# Altium project Velvet_Controller_V2.0_2023.PrjPcb (part 2 of 3)

## Sheet Схема LoRa и RFID Velvet Controller.SchDoc
size A3; SheetNumber: 3; SheetTotal: 6
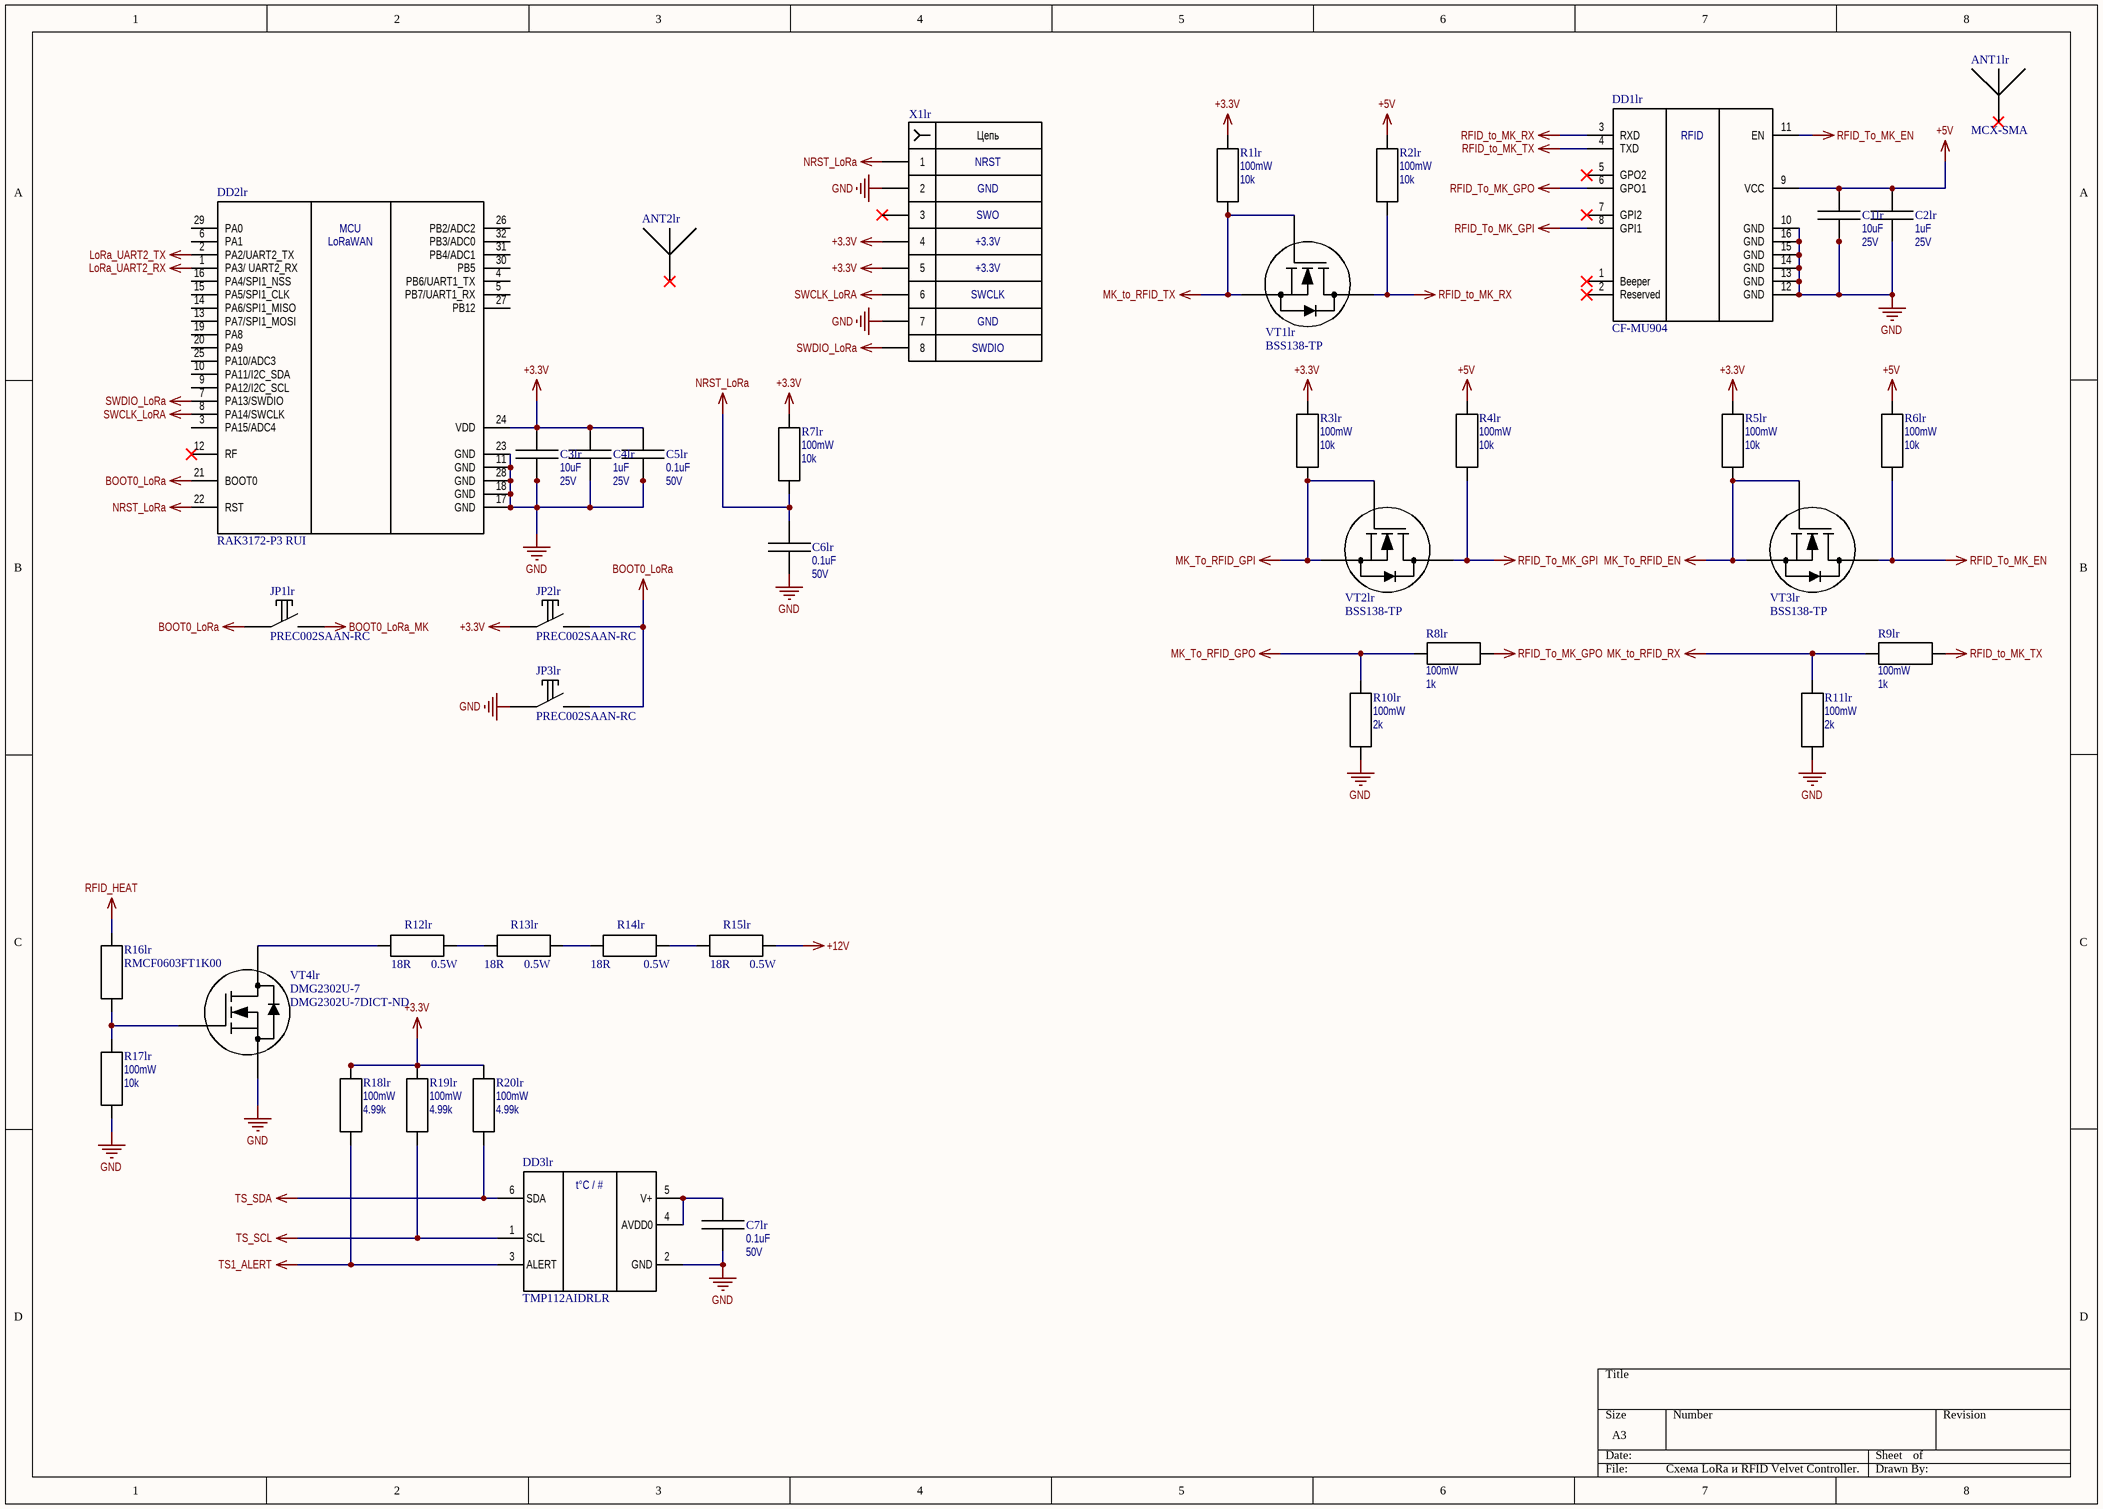
[diagram p3: Схема LoRa и RFID Velvet Controller.SchDoc]

### Parts
ANT1lr  MCX-SMA  (mechanical)
ANT2lr  CA-DKCA0-152L0-AJI0-O  (value not drawn)  (mechanical)
C1lr  Capacitance: 10uF  Rated Voltage: 25V  [CAP 1206 IPC MAX]  (hidden comment: CL31B106KAHNNNE)
C2lr  Capacitance: 1uF  Rated Voltage: 25V  [CAP 0603 IPC MAX]  (hidden comment: TMK107BJ105KA-T)
C3lr  Capacitance: 10uF  Rated Voltage: 25V  [CAP 1206 IPC MAX]  (hidden comment: CL31B106KAHNNNE)
C4lr  Capacitance: 1uF  Rated Voltage: 25V  [CAP 0603 IPC MAX]  (hidden comment: TMK107BJ105KA-T)
C5lr  Capacitance: 0.1uF  Rated Voltage: 50V  [CAP 0603 IPC MAX]  (hidden comment: GCM188R71H104KA57D)
C6lr  Capacitance: 0.1uF  Rated Voltage: 50V  [CAP 0603 IPC MAX]  (hidden comment: GCM188R71H104KA57D)
C7lr  Capacitance: 0.1uF  Rated Voltage: 50V  [CAP 0603 IPC MAX]  (hidden comment: GCM188R71H104KA57D)
DD1lr  CF-MU904  [CF-MU904]
DD2lr  RAK3172-P3 RUI  [RAK3172]
DD3lr  TMP112AIDRLR  [SOT-563]
JP1lr  PREC002SAAN-RC  [2P TH 2.54mm]
JP2lr  PREC002SAAN-RC  [2P TH 2.54mm]
JP3lr  PREC002SAAN-RC  [2P TH 2.54mm]
R1lr  Power Rated: 100mW  Resistance: 10k  [RES 0603 IPC MAX]  (hidden comment: RMCF0603JT10K0)
R2lr  Power Rated: 100mW  Resistance: 10k  [RES 0603 IPC MAX]  (hidden comment: RMCF0603JT10K0)
R3lr  Power Rated: 100mW  Resistance: 10k  [RES 0603 IPC MAX]  (hidden comment: RMCF0603JT10K0)
R4lr  Power Rated: 100mW  Resistance: 10k  [RES 0603 IPC MAX]  (hidden comment: RMCF0603JT10K0)
R5lr  Power Rated: 100mW  Resistance: 10k  [RES 0603 IPC MAX]  (hidden comment: RMCF0603JT10K0)
R6lr  Power Rated: 100mW  Resistance: 10k  [RES 0603 IPC MAX]  (hidden comment: RMCF0603JT10K0)
R7lr  Power Rated: 100mW  Resistance: 10k  [RES 0603 IPC MAX]  (hidden comment: RMCF0603JT10K0)
R8lr  Rated Power: 100mW  Resistance: 1k  [RES 0603 IPC MAX]  (hidden comment: RMCF0603FT1K00)
R9lr  Rated Power: 100mW  Resistance: 1k  [RES 0603 IPC MAX]  (hidden comment: RMCF0603FT1K00)
R10lr  Rated Power: 100mW  Resistance: 2k  [RES 0603 IPC MAX]  (hidden comment: RMCF0603FT2K00)
R11lr  Rated Power: 100mW  Resistance: 2k  [RES 0603 IPC MAX]  (hidden comment: RMCF0603FT2K00)
R12lr  Resistance: 18R  Rated Power: 0.5W  [RES 1210]  (hidden comment: RMCF1210JT18R0)
R13lr  Resistance: 18R  Rated Power: 0.5W  [RES 1210]  (hidden comment: RMCF1210JT18R0)
R14lr  Resistance: 18R  Rated Power: 0.5W  [RES 1210]  (hidden comment: RMCF1210JT18R0)
R15lr  Resistance: 18R  Rated Power: 0.5W  [RES 1210]  (hidden comment: RMCF1210JT18R0)
R16lr  RMCF0603FT1K00  [RES 0603 IPC MAX]
R17lr  Power Rated: 100mW  Resistance: 10k  [RES 0603 IPC MAX]  (hidden comment: RMCF0603JT10K0)
R18lr  Rated Power: 100mW  Resistance: 4.99k  [RES 0603 IPC MAX]  (hidden comment: RC0603FR-074K99L)
R19lr  Rated Power: 100mW  Resistance: 4.99k  [RES 0603 IPC MAX]  (hidden comment: RC0603FR-074K99L)
R20lr  Rated Power: 100mW  Resistance: 4.99k  [RES 0603 IPC MAX]  (hidden comment: RC0603FR-074K99L)
VT1lr  BSS138-TP  [SOT-23-3]
VT2lr  BSS138-TP  [SOT-23-3]
VT3lr  BSS138-TP  [SOT-23-3]
VT4lr  DMG2302U-7  Supplier Part Number 1: DMG2302U-7DICT-ND  [SOT-23-3]
X1lr  TSW-104-07-F-D  [HEADER 2.54mm 2ROW 8PIN]  (value not drawn)

### Nets
+3.3V: C3lr.1 C4lr.1 C5lr.1 DD2lr.24(VDD) JP2lr.1 R1lr.2 R3lr.2 R5lr.2 R7lr.2 R18lr.2 R19lr.2 R20lr.2 X1lr.4 X1lr.5
+5V: C1lr.1 C2lr.1 DD1lr.9(VCC) R2lr.2 R4lr.2 R6lr.2
+12V: R15lr.2
BOOT0_LoRa: DD2lr.21(BOOT0) JP1lr.1 JP2lr.2 JP3lr.2
BOOT0_LoRa_MK: JP1lr.2
GND: C1lr.2 C2lr.2 C3lr.2 C4lr.2 C5lr.2 C6lr.2 C7lr.2 DD1lr.10(GND) DD1lr.12(GND) DD1lr.13(GND) DD1lr.14(GND) DD1lr.15(GND) DD1lr.16(GND) DD2lr.11(GND) DD2lr.17(GND) DD2lr.18(GND) DD2lr.23(GND) DD2lr.28(GND) DD3lr.2(GND) JP3lr.1 R10lr.1 R11lr.1 R17lr.1 VT4lr.2(S) X1lr.2 X1lr.7
LoRa_UART2_RX: DD2lr.1(PA3/_UART2_RX)
LoRa_UART2_TX: DD2lr.2(PA2/UART2_TX)
MK_To_RFID_EN: R5lr.1 VT3lr.1(G) VT3lr.2(S)
MK_To_RFID_GPI: R3lr.1 VT2lr.1(G) VT2lr.2(S)
MK_To_RFID_GPO: R8lr.1 R10lr.2
MK_to_RFID_RX: R9lr.1 R11lr.2
MK_to_RFID_TX: R1lr.1 VT1lr.1(G) VT1lr.2(S)
NRST_LoRa: C6lr.1 DD2lr.22(RST) R7lr.1 X1lr.1
RFID_HEAT: R16lr.2
RFID_To_MK_EN: DD1lr.11(EN) R6lr.1 VT3lr.3(D)
RFID_To_MK_GPI: DD1lr.8(GPI1) R4lr.1 VT2lr.3(D)
RFID_To_MK_GPO: DD1lr.6(GPO1) R8lr.2
RFID_to_MK_RX: DD1lr.3(RXD) R2lr.1 VT1lr.3(D)
RFID_to_MK_TX: DD1lr.4(TXD) R9lr.2
SWCLK_LoRA: DD2lr.8(PA14/SWCLK) X1lr.6
SWDIO_LoRa: DD2lr.7(PA13/SWDIO) X1lr.8
TS1_ALERT: DD3lr.3(ALERT) R18lr.1
TS_SCL: DD3lr.1(SCL) R19lr.1
TS_SDA: DD3lr.6(SDA) R20lr.1
NetC7lr_1: C7lr.1 DD3lr.4(AVDD0) DD3lr.5(V+)
NetR12lr_1: R12lr.1 VT4lr.3(D)
NetR12lr_2: R12lr.2 R13lr.1
NetR13lr_2: R13lr.2 R14lr.1
NetR14lr_2: R14lr.2 R15lr.1
NetR16lr_1: R16lr.1 R17lr.2 VT4lr.1(G)

Not connected (* = marked no-connect by the designer): ANT1lr 1*; ANT2lr 1*; DD1lr 1(Beeper)* 2(Reserved)* 5(GPO2)* 7(GPI2)*; DD2lr 3(PA15/ADC4) 4(PB6/UART1_TX) 5(PB7/UART1_RX) 6(PA1) 9(PA12/I2C_SCL) 10(PA11/I2C_SDA) 12(RF)* 13(PA7/SPI1_MOSI) 14(PA6/SPI1_MISO) 15(PA5/SPI1_CLK) 16(PA4/SPI1_NSS) 19(PA8) 20(PA9) 25(PA10/ADC3) 26(PB2/ADC2) 27(PB12) 29(PA0) 30(PB5) 31(PB4/ADC1) 32(PB3/ADC0); X1lr 3*

### Notes on the sheet
- NRST
- SWO
- GND
- +3.3V
- SWCLK
- SWDIO
- (in symbol CF-MU904) RFID
- (in symbol RAK3172-P3 RUI) MCU
- (in symbol TMP112AIDRLR) t°C / #
- (in symbol TSW-104-07-F-D) Цепь

### Library data of the parts
ANT1lr = MCX-SMA: MCX-Male to SMA RF 15cm connector; Manufacturer 1: DexMRtiC; Style: N-MCX Cable; 1st Contact Gender: Female; 1st Connector Mounting Type: Panel Mount; 2nd Connector: MCX Male Plug Right Angle; 2nd Contact Gender: Male; 2nd Connector Mounting Type: Free Hanging (In-Line); Frequency - Max: 6 GHz; Manufacturer Part Number 1: -; 1st Connector: SMA; Length: 152.00mm; ComponentLink1Description: Aliexpress; ComponentLink1URL: https://aliexpress.ru/item/32231629780.html?algo_pvid=null&algo_expid=null&spm=a2g2w.productlist.search_results.6.4f564aa6TSsm48&sku_id=12000026772307438
ANT2lr = CA-DKCA0-152L0-AJI0-O: WATERPROOF SMA TO IPEX FOR 1.13; Manufacturer 1: Adam Tech; Style: U.FL (UMCC), IPEX MHF1 to SMA; 1st Connector: SMA Jack; 1st Contact Gender: Female; 1st Connector Mounting Type: Panel Mount; 1st Connector Mounting Feature: Bulkhead - Front Side Nut; 2nd Connector: U.FL (UMCC), IPEX MHF1 Plug, Right Angle; 2nd Connector Mounting Type: Free Hanging (In-Line); Frequency - Max: 6 GHz; Manufacturer Part Number 1: CA-DKCA0-152L0-AJI0-O; 2nd Contact Gender: Female; 2nd Connector Mounting Feature: *; Length: 152.00mm
C1lr C3lr = CL31B106KAHNNNE: CAP SMD CER 10UF 25V X7R 1206; Manufacturer 1: Samsung Electro-Mechanics; Tolerance: 10%; Type: Multilayer Ceramic; Manufacturer Part Number 1: CL31B106KAHNNNE; Min Operating Temperature: -55°C; Max Operating Temperature: 125°C; Mounting: SM; Package: 1206; Supplier 1: Digi-Key; Supplier Part Number 1: 1276-1804-1-ND
C2lr C4lr = TMK107BJ105KA-T: CAP SMD CER 1UF 25V X5R 0603; Manufacturer 1: Taiyo Yuden; Tolerance: 10%; Type: Multilayer Ceramic; Manufacturer Part Number 1: TMK107BJ105KA-T; Min Operating Temperature: -55°C; Max Operating Temperature: 85°C; Mounting: SM; Package: 0603; Supplier 1: Digi-Key; Supplier Part Number 1: 587-1248-1-ND
C5lr C6lr C7lr = GCM188R71H104KA57D: as C9p on sheet Схема питания Velvet Controller; Manufacturer Part Number 1: GCM188R71H104KA57D; Min Operating Temperature: -55°C; Max Operating Temperature: 125°C; Mounting: SM; Package: 0603; Supplier 1: Digi-Key; Supplier Part Number 1: 490-4779-1-ND
DD1lr = CF-MU904: UHF RFID Reader Module; Manufacturer 1: ChaFon; Frequency Band 1: 902~928MHz; Frequency Band 2: 865~868MHz; Effective Range: 15m; Tag Buffer Size 1: 370PCS@Max.128bitsEPC; Tag Buffer Size 2: 120PCS@Max.496bitsEPC; Min Supply Voltage: 3.5V; Max Supply Voltage: 5V; RSSI: Yes; Interface: UART; Max Supply Current: 360mA; Manufacturer Part Number 1: CF-MU904; Package: *
DD2lr = RAK3172-P3 RUI: MODULE FOR LORAWAN RAK3172; Manufacturer 1: RAKwireless Technology Limited; Function: Transceiver; Frequency: 433MHz, 470MHz, 864MHz, 865MHz, 868MHz, 915MHz, 920MHz, 923MHz; Min Supply Voltage: 2V; Max Supply Voltage: 3.6V; Max Supply Current: 100mA; Manufacturer Part Number 1: RAK3172-P3 RUI; Min Operating Temperature: -40°C; Max Operating Temperature: 85°C; RF Type: LoRaWAN; Package: 32-SMD Module
DD3lr = TMP112AIDRLR: SOT-563 TEMPERATURE SENSORS ROHS; Manufacturer 1: UMW; Max Accuracy: ±0.1°C; Min Accuracy: ±1°C; Resolution: 12b; Interface: I²C/SMBus; Manufacturer Part Number 1: TMP112AIDRLR; Max Operating Temperature: 150°C; Min Operating Temperature: -55°C; Mounting Type: SM; Package: SOT-563; Supplier 1: Digi-Key; Supplier Part Number 1: 296-38578-1-ND
JP1lr JP2lr JP3lr = PREC002SAAN-RC: CONN HEADER VERT 2POS 2.54MM; Manufacturer 1: Sullins Connector Solutions; Manufacturer Part Number 1: PREC002SAAN-RC; Number of Pins: 2; Pitch: 2.54mm
R1lr R2lr R3lr R4lr R5lr R6lr R7lr R17lr = RMCF0603JT10K0: as R4mc on sheet Схема МК и датчиков Velvet Controller; Manufacturer Part Number 1: RMCF0603JT10K0; Min Operating Temperature: -55°C; Max Operating Temperature: 155°C; Tolerance: 5%; Package: 0603; Ratings: AEC-Q200; Supplier 1: Digi-Key; Supplier Part Number 1: RMCF0603JT10K0CT-ND
R8lr R9lr = RMCF0603FT1K00: RES SMD 1K OHM 1% 1/10W 0603; Manufacturer 1: Stackpole Electronics Inc; Rated Voltage: 75V; Qualification: AEC-Q200; Manufacturer Part Number 1: RMCF0603FT1K00; Tolerance: 1%; Package: 0603; Min Operating Temperature: -55°C; Max Operating Temperature: 155°C
R10lr R11lr = RMCF0603FT2K00: RES SMD 2K OHM 1% 1/10W 0603; Manufacturer 1: Stackpole Electronics Inc; Rated Voltage: 75V; Qualification: AEC-Q200; Manufacturer Part Number 1: RMCF0603FT2K00; Tolerance: 1%; Package: 0603; Min Operating Temperature: -55°C; Max Operating Temperature: 155°C
R12lr R13lr R14lr R15lr = RMCF1210JT18R0: RES SMD 18 OHM 5% 1/2W 1210; Manufacturer 1: Stackpole Electronics Inc; Rated Voltage: 200V; Qualification: AEC-Q200; Manufacturer Part Number 1: RMCF1210JT18R0; Tolerance: 5%; Package: 1210; Min Operating Temperature: -55°C; Max Operating Temperature: 155°C
R16lr = RMCF0603FT1K00: RES SMD 1K OHM 1% 1/10W 0603; Manufacturer 1: Stackpole Electronics Inc; Rated Voltage: 75V; Rated Power: 100mW; Qualification: AEC-Q200; Manufacturer Part Number 1: RMCF0603FT1K00; Resistance: 1k; Tolerance: 1%; Package: 0603; Min Operating Temperature: -55°C; Max Operating Temperature: 155°C
R18lr R19lr R20lr = RC0603FR-074K99L: RES SMD 4.99K OHM 1% 1/10W 0603; Manufacturer 1: YAGEO; Rated Voltage: 75V; Manufacturer Part Number 1: RC0603FR-074K99L; Tolerance: 1%; Package: 0603; Min Operating Temperature: -55°C; Max Operating Temperature: 155°C; Qualification: -
VT1lr VT2lr VT3lr = BSS138-TP: MOSFET N-CH 50V 220MA SOT23; Manufacturer 1: Micro Commercial Co; Type: P-Chanel; Rds On (Max): 3.5Ohm; Vth: 1.5V; Gate Charge: 1.65nC; Vgs Max: 20V; Input Capacitance: 60pF; Max Power Dissipation: 350mW; Vds Max: 50V; Max Drain Current: 220mA; Min Operating Temperature: -55°C; Max Operating Temperature: 150°C; Mounting Type: SM; Package: SOT-23; Manufacturer Part Number 1: BSS138-TP; Supplier 1: Digi-Key; Supplier Part Number 1: BSS138-TPMSCT-ND
VT4lr = DMG2302U-7: MOSFET N-CH 20V 4.2A SOT23-3; Manufacturer 1: Diodes Incorporated; Type: P-Chanel; Rds On (Max): 90mOhm; Vth: 1V; Gate Charge: 7nC; Vgs Max: 8V; Input Capacitance: 594pF; Max Power Dissipation: 800mW; Vds Max: 20V; Max Drain Current: 4.2A; Min Operating Temperature: -55°C; Max Operating Temperature: 150°C; Mounting Type: SM; Package: SOT-23-3; Manufacturer Part Number 1: DMG2302U-7; Supplier 1: Digi-Key
X1lr = TSW-104-07-F-D: CONN HEADER VERT 8POS 2.54MM 2ROWx4; Manufacturer 1: Samtec Inc.; Rated Voltage: 400V; Rated Current: 2A; Contact Length - Mating: 5.84mm; Overall Contact Length: 10.92mm; Min Operating Temperatire: -55℃; Max Operating Temperature: 125℃; Contact Length - Post: 2.54mm; Insulation Height: 2.54mm; Manufacturer Part Number 1: TSW-104-07-F-D; Pitch: 2.54mm; Supplier 1: Digi-Key; Supplier Part Number 1: SAM8996-ND

## Sheet Схема Wi-Fi Velvet Controller.SchDoc
size A3; SheetNumber: 4; SheetTotal: 6
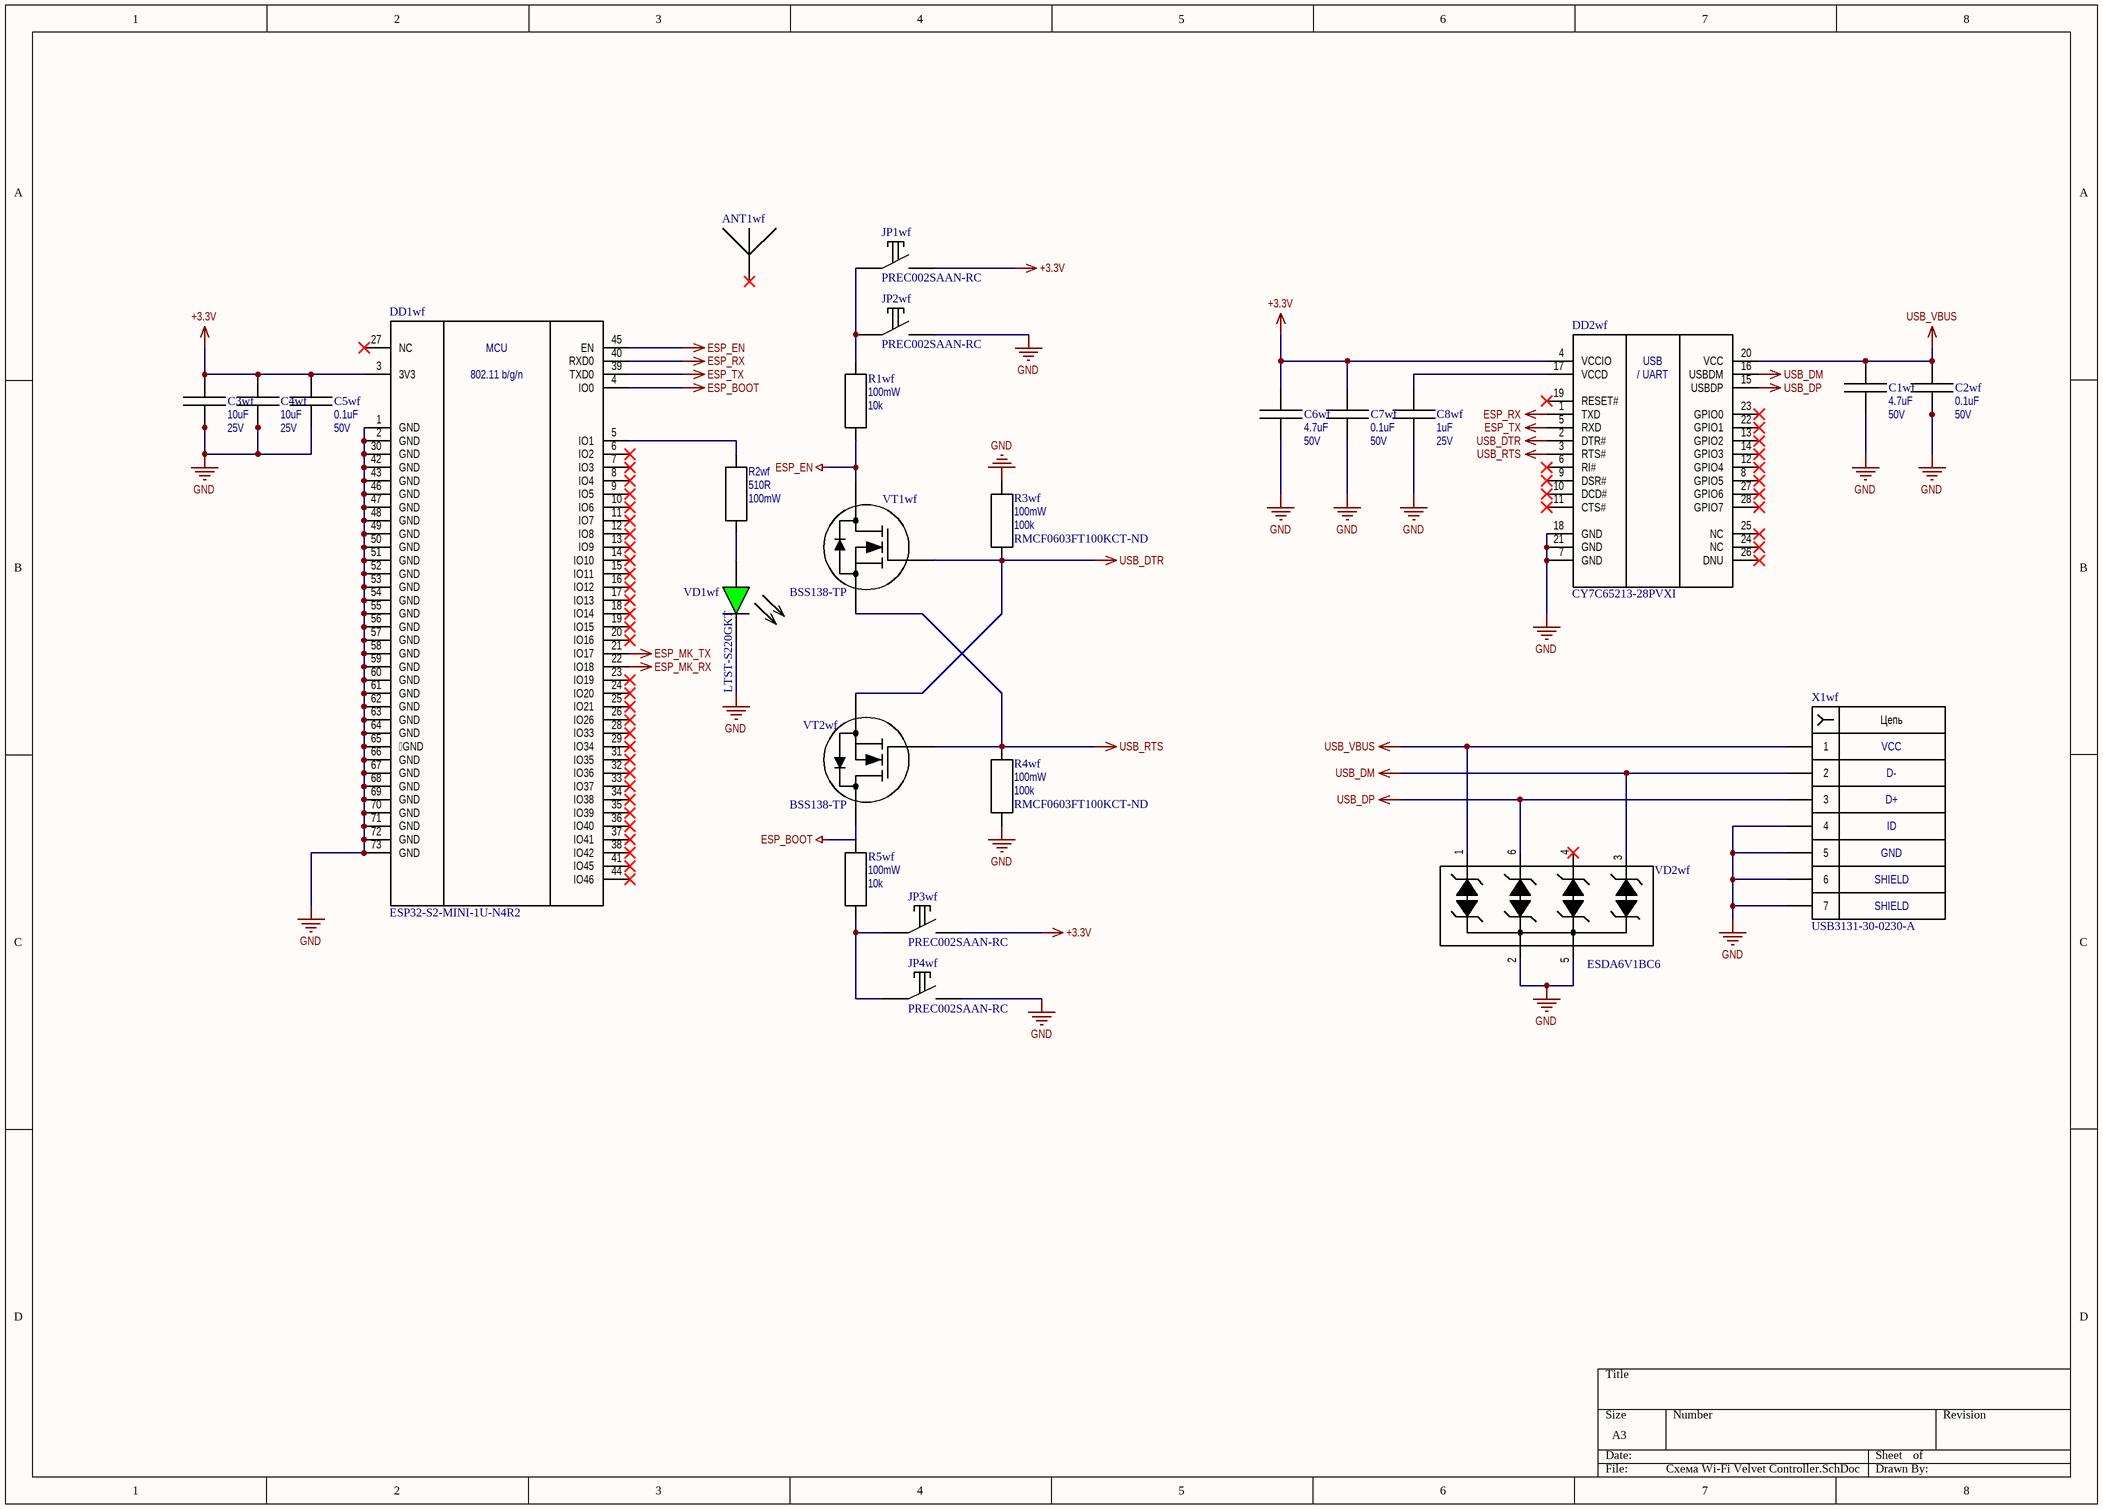
[diagram p4: Схема Wi-Fi Velvet Controller.SchDoc]

### Parts
ANT1wf  CA-DKCA0-152L0-AJI0-O  (value not drawn)  (mechanical)
C1wf  Capacitance: 4.7uF  Rated Voltage: 50V  [CAP 0805 IPC MAX]  (hidden comment: CL21A475KBQNNNE)
C2wf  Capacitance: 0.1uF  Rated Voltage: 50V  [CAP 0603 IPC MAX]  (hidden comment: GCM188R71H104KA57D)
C3wf  Capacitance: 10uF  Rated Voltage: 25V  [CAP 1206 IPC MAX]  (hidden comment: CL31B106KAHNNNE)
C4wf  Capacitance: 10uF  Rated Voltage: 25V  [CAP 1206 IPC MAX]  (hidden comment: CL31B106KAHNNNE)
C5wf  Capacitance: 0.1uF  Rated Voltage: 50V  [CAP 0603 IPC MAX]  (hidden comment: GCM188R71H104KA57D)
C6wf  Capacitance: 4.7uF  Rated Voltage: 50V  [CAP 0805 IPC MAX]  (hidden comment: CL21A475KBQNNNE)
C7wf  Capacitance: 0.1uF  Rated Voltage: 50V  [CAP 0603 IPC MAX]  (hidden comment: GCM188R71H104KA57D)
C8wf  Capacitance: 1uF  Rated Voltage: 25V  [CAP 0603 IPC MAX]  (hidden comment: TMK107BJ105KA-T)
DD1wf  ESP32-S2-MINI-1U-N4R2  [ESP32­S2­MINI­1U]
DD2wf  CY7C65213-28PVXI  [TSSOP-28]
JP1wf  PREC002SAAN-RC  [2P TH 2.54mm]
JP2wf  PREC002SAAN-RC  [2P TH 2.54mm]
JP3wf  PREC002SAAN-RC  [2P TH 2.54mm]
JP4wf  PREC002SAAN-RC  [2P TH 2.54mm]
R1wf  Power Rated: 100mW  Resistance: 10k  [RES 0603 IPC MAX]  (hidden comment: RMCF0603JT10K0)
R2wf  Resistance: 510R  Power Rating: 100mW  [RES 0603 IPC MAX]  (hidden comment: RMCF0603JT510R)
R3wf  Power Rated: 100mW  Resistance: 100k  Supplier Part Number 1: RMCF0603FT100KCT-ND  [RES 0603 IPC MAX]  (hidden comment: RMCF0603FT100K)
R4wf  Power Rated: 100mW  Resistance: 100k  Supplier Part Number 1: RMCF0603FT100KCT-ND  [RES 0603 IPC MAX]  (hidden comment: RMCF0603FT100K)
R5wf  Power Rated: 100mW  Resistance: 10k  [RES 0603 IPC MAX]  (hidden comment: RMCF0603JT10K0)
VD1wf  LTST-S220GKT  [0805 DIODE]
VD2wf  ESDA6V1BC6  [SOT-23-6]
VT1wf  BSS138-TP  [SOT-23-3]
VT2wf  BSS138-TP  [SOT-23-3]
X1wf  USB3131-30-0230-A  [USB3131-30-0230-A]

### Nets
+3.3V: C3wf.1 C4wf.1 C5wf.1 C6wf.1 C7wf.1 DD1wf.3(3V3) DD2wf.4(VCCIO) JP1wf.2 JP3wf.2
ESP_BOOT: DD1wf.4(IO0) R5wf.2 VT2wf.3(D)
ESP_EN: DD1wf.45(EN) R1wf.1 VT1wf.3(D)
ESP_MK_RX: DD1wf.22(IO18)
ESP_MK_TX: DD1wf.21(IO17)
ESP_RX: DD1wf.40(RXD0) DD2wf.1(TXD)
ESP_TX: DD1wf.39(TXD0) DD2wf.5(RXD)
GND: C1wf.2 C2wf.2 C3wf.2 C4wf.2 C5wf.2 C6wf.2 C7wf.2 C8wf.2 DD1wf.1(GND) DD1wf.2(GND) DD1wf.30(GND) DD1wf.42(GND) DD1wf.43(GND) DD1wf.46(GND) DD1wf.47(GND) DD1wf.48(GND) DD1wf.49(GND) DD1wf.50(GND) DD1wf.51(GND) DD1wf.52(GND) DD1wf.53(GND) DD1wf.54(GND) DD1wf.55(GND) DD1wf.56(GND) DD1wf.57(GND) DD1wf.58(GND) DD1wf.59(GND) DD1wf.60(GND) DD1wf.61(GND) DD1wf.62(GND) DD1wf.63(GND) DD1wf.64(GND) DD1wf.65(GND) DD1wf.66(GND) DD1wf.67(GND) DD1wf.68(GND) DD1wf.69(GND) DD1wf.70(GND) DD1wf.71(GND) DD1wf.72(GND) DD1wf.73(GND) DD2wf.7(GND) DD2wf.18(GND) DD2wf.21(GND) JP2wf.2 JP4wf.2 R3wf.2 R4wf.1 VD1wf.2 VD2wf.2 VD2wf.5 X1wf.4 X1wf.5 X1wf.6 X1wf.7
USB_DM: DD2wf.16(USBDM) VD2wf.3 X1wf.2
USB_DP: DD2wf.15(USBDP) VD2wf.6 X1wf.3
USB_DTR: DD2wf.2(DTR#) R3wf.1 VT1wf.1(G) VT2wf.2(S)
USB_RTS: DD2wf.3(RTS#) R4wf.2 VT1wf.2(S) VT2wf.1(G)
USB_VBUS: C1wf.1 C2wf.1 DD2wf.20(VCC) VD2wf.1 X1wf.1
NetC8wf_1: C8wf.1 DD2wf.17(VCCD)
NetDD1wf_5: DD1wf.5(IO1) R2wf.1
NetJP1wf_1: JP1wf.1 JP2wf.1 R1wf.2
NetJP3wf_1: JP3wf.1 JP4wf.1 R5wf.1
NetR2wf_2: R2wf.2 VD1wf.1

Not connected (* = marked no-connect by the designer): ANT1wf 1*; DD1wf 6(IO2)* 7(IO3)* 8(IO4)* 9(IO5)* 10(IO6)* 11(IO7)* 12(IO8)* 13(IO9)* 14(IO10)* 15(IO11)* 16(IO12)* 17(IO13)* 18(IO14)* 19(IO15)* 20(IO16)* 23(IO19)* 24(IO20)* 25(IO21)* 26(IO26)* 27(NC)* 28(IO33)* 29(IO34)* 31(IO35)* 32(IO36)* 33(IO37)* 34(IO38)* 35(IO39)* 36(IO40)* 37(IO41)* 38(IO42)* 41(IO45)* 44(IO46)*; DD2wf 6(RI#)* 8(GPIO5)* 9(DSR#)* 10(DCD#)* 11(CTS#)* 12(GPIO4)* 13(GPIO2)* 14(GPIO3)* 19(RESET#)* 22(GPIO1)* 23(GPIO0)* 24(NC)* 25(NC)* 26(DNU)* 27(GPIO6)* 28(GPIO7)*; VD2wf 4*

### Notes on the sheet
- (in symbol CY7C65213-28PVXI) USB; / UART
- (in symbol ESP32-S2-MINI-1U-N4R2) MCU; 802.11 b/g/n
- (in symbol USB3131-30-0230-A) Цепь; VCC; D-; D+; ID; GND; SHIELD

### Library data of the parts
ANT1wf = CA-DKCA0-152L0-AJI0-O: as ANT2lr on sheet Схема LoRa и RFID Velvet Controller; Manufacturer Part Number 1: CA-DKCA0-152L0-AJI0-O; 2nd Contact Gender: Female; 2nd Connector Mounting Feature: *; Length: 152.00mm
C1wf C6wf = CL21A475KBQNNNE: as C6p on sheet Схема питания Velvet Controller; Manufacturer Part Number 1: CL21A475KBQNNNE; Min Operating Temperature: -55°C; Max Operating Temperature: 85°C; Mounting: SM; Package: 0805; Supplier 1: Digi-Key; Supplier Part Number 1: 1276-1248-1-ND
C2wf C5wf C7wf = GCM188R71H104KA57D: as C9p on sheet Схема питания Velvet Controller; Manufacturer Part Number 1: GCM188R71H104KA57D; Min Operating Temperature: -55°C; Max Operating Temperature: 125°C; Mounting: SM; Package: 0603; Supplier 1: Digi-Key; Supplier Part Number 1: 490-4779-1-ND
C3wf C4wf = CL31B106KAHNNNE: as C1lr on sheet Схема LoRa и RFID Velvet Controller; Manufacturer Part Number 1: CL31B106KAHNNNE; Min Operating Temperature: -55°C; Max Operating Temperature: 125°C; Mounting: SM; Package: 1206; Supplier 1: Digi-Key; Supplier Part Number 1: 1276-1804-1-ND
C8wf = TMK107BJ105KA-T: as C2lr on sheet Схема LoRa и RFID Velvet Controller; Manufacturer Part Number 1: TMK107BJ105KA-T; Min Operating Temperature: -55°C; Max Operating Temperature: 85°C; Mounting: SM; Package: 0603; Supplier 1: Digi-Key; Supplier Part Number 1: 587-1248-1-ND
DD1wf = ESP32-S2-MINI-1U-N4R2: SMD MODULE, ESP32-S2FN4R2 WITH WIFI 802.11B/G/N TRANCEIVER MODULE 2.4GHZ; Manufacturer 1: Espressif Systems; Data Rate: 150Mbps; Antenna Type: IPEX; Memory Size: 6MB Flash, 128kB ROM, 336kB SRAM; Supply Voltage: 3.3V; Max Supply Current: TX=310mA, RX=68mA, CPU = 32mA; Manufacturer Part Number 1: ESP32-S2-MINI-1U-N4R2; Min Operating Temperature: -40°C; Max Operating Temperature: 85°C; RF Standard: WiFi; Protocol: 802.11b/g/n; Mounting: SM; Package: 65-SMD Module; Supplier 1: Digi-Key; Supplier Part Number 1: 1965-ESP32-S2-MINI-1U-N4R2CT-ND
DD2wf = CY7C65213-28PVXI: IC USB-SERIAL PART 28SSOP; Manufacturer 1: Infineon Technologies; Function: USB to UART; Standards: USB 2.0; Supply Voltage: 1.71V ~ 5.5V; Max Supply Current: 20mA; Manufacturer Part Number 1: CY7C65213-28PVXI; Min Operating Temperature: -40°C; Max Operating Temperature: 85°C; Package: 28-SSOP; Mounting: *
JP1wf JP2wf JP3wf JP4wf = PREC002SAAN-RC: as JP1lr on sheet Схема LoRa и RFID Velvet Controller; Manufacturer Part Number 1: PREC002SAAN-RC; Number of Pins: 2; Pitch: 2.54mm
R1wf R5wf = RMCF0603JT10K0: as R4mc on sheet Схема МК и датчиков Velvet Controller; Manufacturer Part Number 1: RMCF0603JT10K0; Min Operating Temperature: -55°C; Max Operating Temperature: 155°C; Tolerance: 5%; Package: 0603; Ratings: AEC-Q200; Supplier 1: Digi-Key; Supplier Part Number 1: RMCF0603JT10K0CT-ND
R2wf = RES GOST: RES 510 OHM 5% 1/10W 0603; Manufacturer 1: Stackpole Electronics Inc; Manufacturer Part Number 1: RMCF0603JT510R; Tolerance: 5%; Min Operating Temperature: -55°C; Max Operating Temperature: 155°C; Package: 0603
R3wf R4wf = RMCF0603FT100K: as R3p on sheet Схема питания Velvet Controller; Manufacturer Part Number 1: RMCF0603FT100K; Min Operating Temperature: -55°C; Max Operating Temperature: 155°C; Tolerance: 5%; Package: 0603; Ratings: AEC-Q200; Supplier 1: Digi-Key
VD1wf = LTST-S220GKT: as VD2p on sheet Схема питания Velvet Controller; Manufacturer Part Number 1: LTST-S220GKT; Max Operating Temperature: +85°C; Package: 0805
VD2wf = ESDA6V1BC6: TVS DIODE 5VWM SOT23-6; Manufacturer 1: STMicroelectronics; Voltage - Reverse Standoff (Typ): 5V; Voltage - Breakdown (Min): 6.1V; Type: Biderectional; Number Of Chanels: 4; Max Pulse Power: 80W; Manufacturer Part Number 1: ESDA6V1BC6; Mounting: SM; Max Operating Temperature: 125°C; Min Operating Temperature: -40°C; Package: SOT-23-6
VT1wf VT2wf = BSS138-TP: as VT1lr on sheet Схема LoRa и RFID Velvet Controller; Vds Max: 50V; Max Drain Current: 220mA; Min Operating Temperature: -55°C; Max Operating Temperature: 150°C; Mounting Type: SM; Package: SOT-23; Manufacturer Part Number 1: BSS138-TP; Supplier 1: Digi-Key; Supplier Part Number 1: BSS138-TPMSCT-ND
X1wf = USB3131-30-0230-A: MICRO B SKT, VERTICAL, TH, 30",; Manufacturer 1: GCT; Specifications: USB 2.0; Gender: Receptacle; Connector Type: USB - micro B; Current Rating (Amps): 1A; Number of Ports: 1; Voltage - Rated: 30V; Manufacturer Part Number 1: USB3131-30-0230-A; Min Operating Temperature: -55°C; Max Operating Temperature: 85°C; Mounting: T/H; Mounting Feature: Vertical

## Sheet Схема GSM Velvet Controller.SchDoc
size A3; SheetNumber: 5; SheetTotal: 6
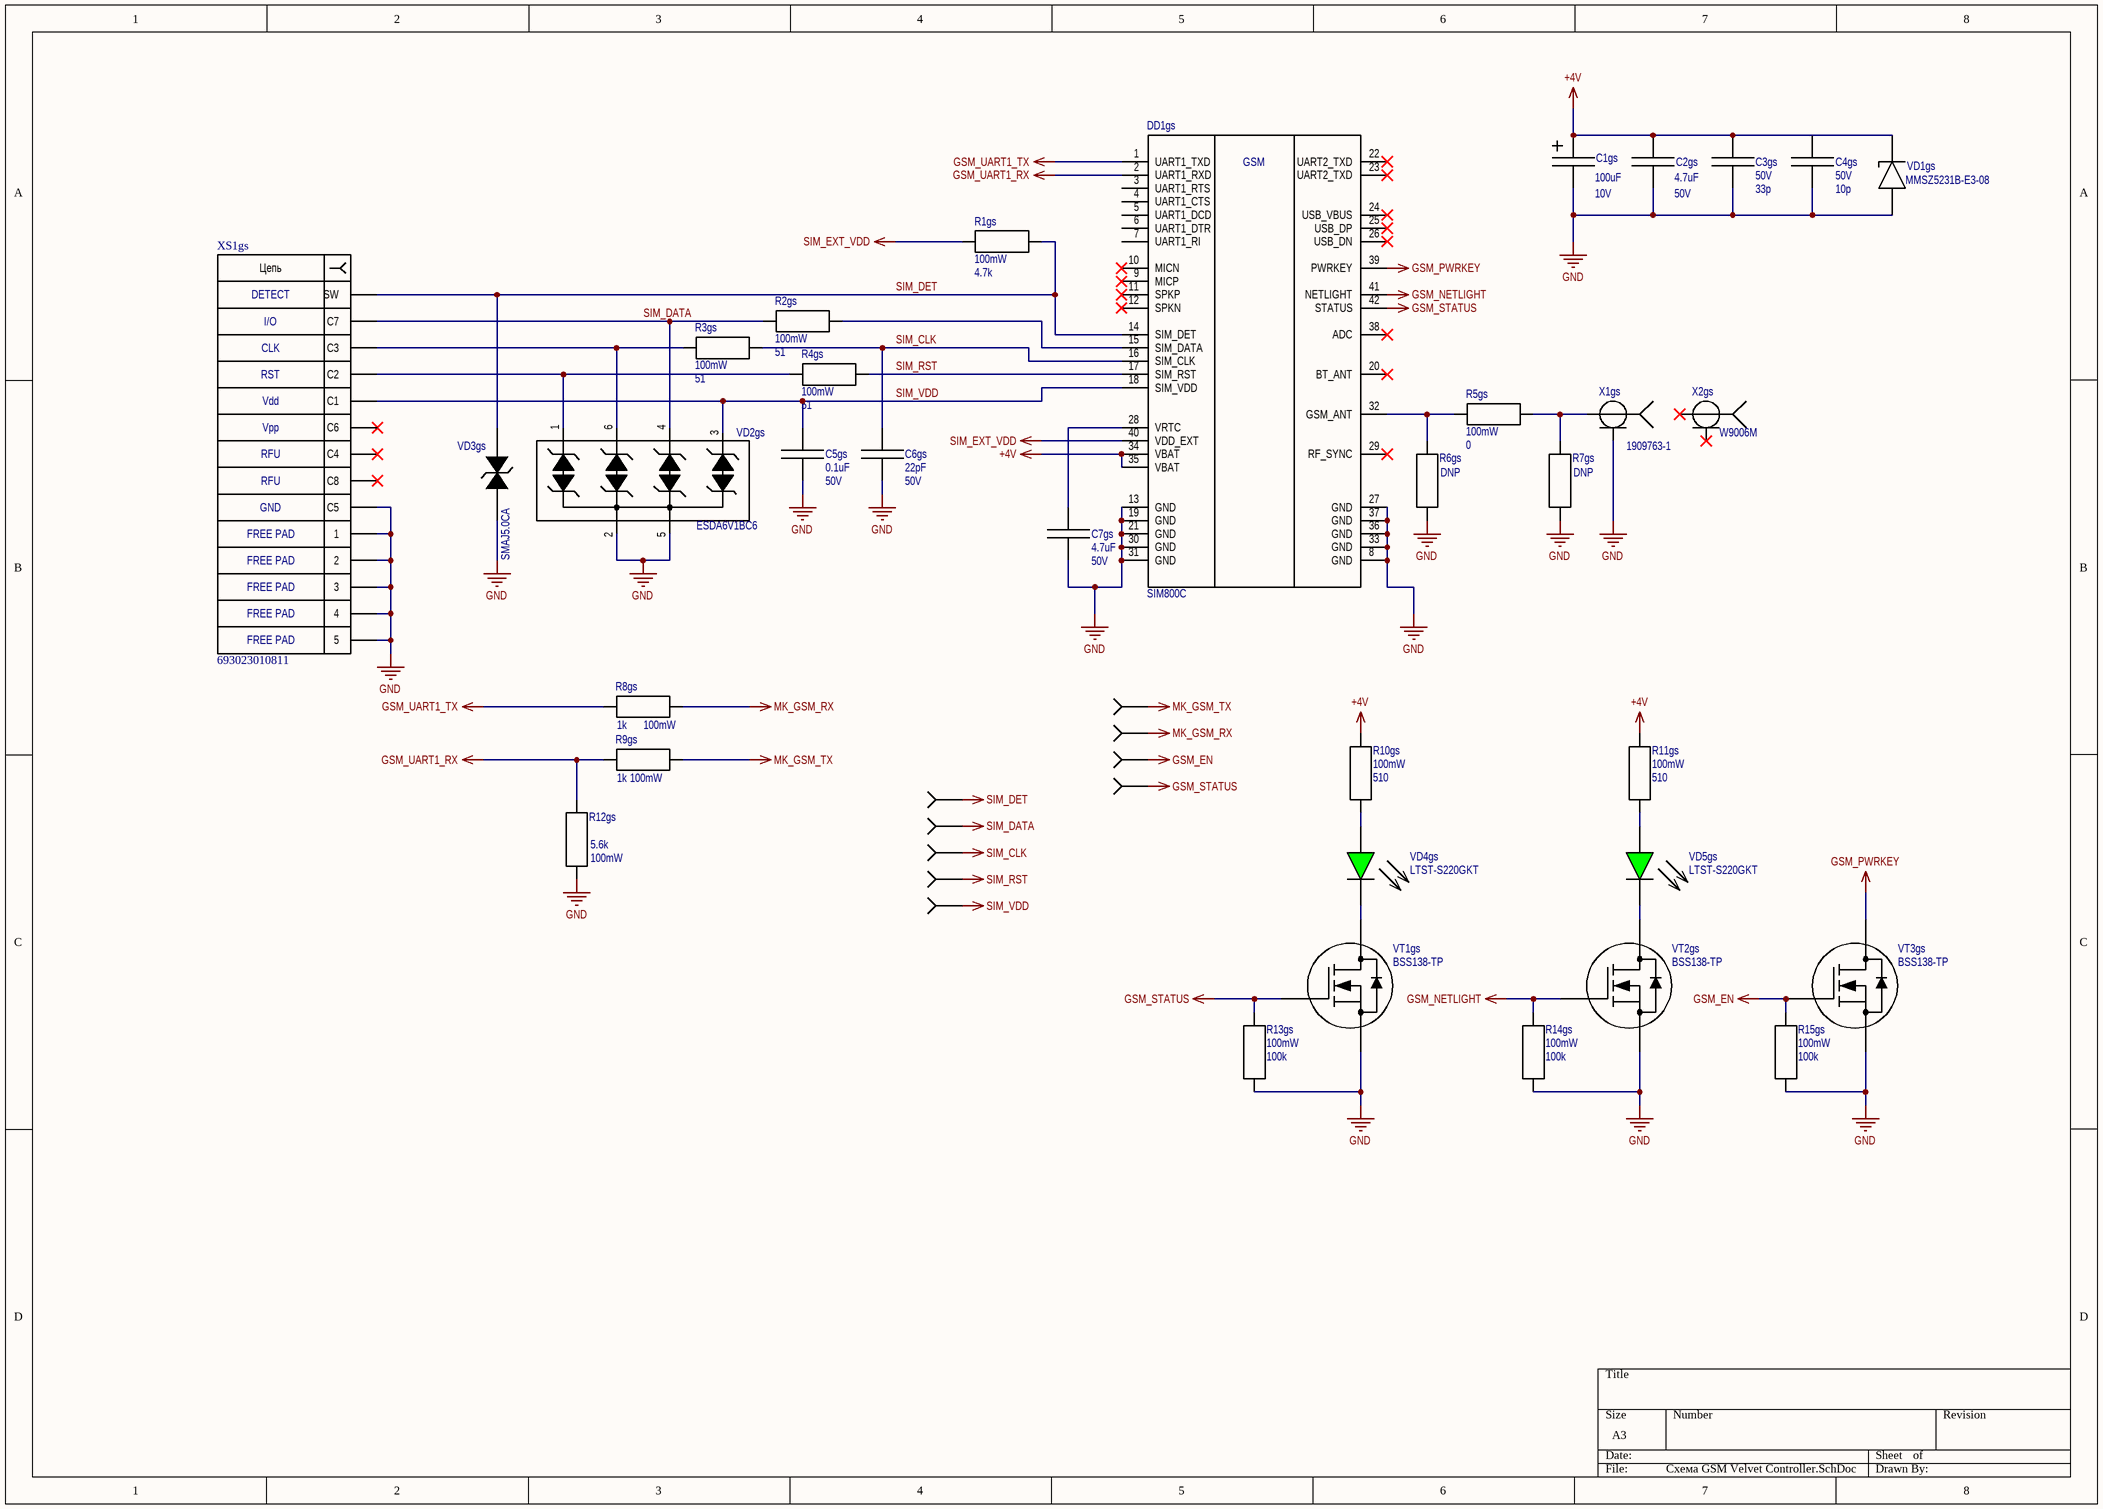
[diagram p5: Схема GSM Velvet Controller.SchDoc]

### Parts
C1gs  Capacitance: 100uF  Rated Voltage: 10V  [CAP 2917 (D)]  (hidden comment: TPSD107M010R0050)
C2gs  Capacitance: 4.7uF  Rated Voltage: 50V  [CAP 0805 IPC MAX]  (hidden comment: CL21A475KBQNNNE)
C3gs  Rated Voltage: 50V  Capacitance: 33p  [CAP 0603 IPC MAX]  (hidden comment: C0603C330J5GAC7867)
C4gs  Rated Voltage: 50V  Capacitance: 10p  [CAP 0603 IPC MAX]  (hidden comment: CC0603JRNPO9BN100)
C5gs  Capacitance: 0.1uF  Rated Voltage: 50V  [CAP 0603 IPC MAX]  (hidden comment: GCM188R71H104KA57D)
C6gs  Capacitance: 22pF  Rated Voltage: 50V  [CAP 0603 IPC MAX]  (hidden comment: CC0603JRNPO9BN220)
C7gs  Capacitance: 4.7uF  Rated Voltage: 50V  [CAP 0805 IPC MAX]  (hidden comment: CL21A475KBQNNNE)
DD1gs  SIM800C  [SIM-800C]
R1gs  Rated Power: 100mW  Resistance: 4.7k  [RES 0603 IPC MAX]  (hidden comment: RMCF0603FT4K70)
R2gs  Rated Power: 100mW  Resistance: 51  [RES 0603 IPC MAX]  (hidden comment: RMCF0603FT51R0)
R3gs  Rated Power: 100mW  Resistance: 51  [RES 0603 IPC MAX]  (hidden comment: RMCF0603FT51R0)
R4gs  Rated Power: 100mW  Resistance: 51  [RES 0603 IPC MAX]  (hidden comment: RMCF0603FT51R0)
R5gs  Rated Power: 100mW  Resistance: 0  [RES 0603 IPC MAX]  (hidden comment: RMCF0603ZT0R00)
R6gs  DNP  [RES 0603 IPC MAX]
R7gs  DNP  [RES 0603 IPC MAX]
R8gs  Resistance: 1k  Rated Power: 100mW  [RES 0603 IPC MAX]  (hidden comment: RMCF0603FT1K00)
R9gs  Resistance: 1k  Rated Power: 100mW  [RES 0603 IPC MAX]  (hidden comment: RMCF0603FT1K00)
R10gs  Power Rated: 100mW  Resistance: 510  [RES 0603 IPC MAX]  (hidden comment: RMCF0603JT510R)
R11gs  Power Rated: 100mW  Resistance: 510  [RES 0603 IPC MAX]  (hidden comment: RMCF0603JT510R)
R12gs  Resistance: 5.6k  Rated Power: 100mW  [RES 0603 IPC MAX]  (hidden comment: RMCF0603FT5K60)
R13gs  Power Rated: 100mW  Resistance: 100k  [RES 0603 IPC MAX]  (hidden comment: RMCF0603FT100K)
R14gs  Power Rated: 100mW  Resistance: 100k  [RES 0603 IPC MAX]  (hidden comment: RMCF0603FT100K)
R15gs  Power Rated: 100mW  Resistance: 100k  [RES 0603 IPC MAX]  (hidden comment: RMCF0603FT100K)
TP2gs  1.2MM TP  [TESTPOINT 1.2mm]  (value not drawn)  (no BOM)
TP4gs  1.2MM TP  [TESTPOINT 1.2mm]  (value not drawn)  (no BOM)
TP5gs  1.2MM TP  [TESTPOINT 1.2mm]  (value not drawn)  (no BOM)
TP6gs  1.2MM TP  [TESTPOINT 1.2mm]  (value not drawn)  (no BOM)
TP7gs  1.2MM TP  [TESTPOINT 1.2mm]  (value not drawn)  (no BOM)
TP9gs  1.2MM TP  [TESTPOINT 1.2mm]  (value not drawn)  (no BOM)
TP10gs  1.2MM TP  [TESTPOINT 1.2mm]  (value not drawn)  (no BOM)
TP11gs  1.2MM TP  [TESTPOINT 1.2mm]  (value not drawn)  (no BOM)
TP12gs  1.2MM TP  [TESTPOINT 1.2mm]  (value not drawn)  (no BOM)
VD1gs  MMSZ5231B-E3-08  [SOD-123 (Marked)]
VD2gs  ESDA6V1BC6  [SOT-23-6]
VD3gs  SMAJ5.0CA  [DO-214AC Bidirectional]
VD4gs  LTST-S220GKT  [0805 DIODE]
VD5gs  LTST-S220GKT  [0805 DIODE]
VT1gs  BSS138-TP  [SOT-23-3]
VT2gs  BSS138-TP  [SOT-23-3]
VT3gs  BSS138-TP  [SOT-23-3]
X1gs  1909763-1  [1909763-1]
X2gs  W9006M  (mechanical)
XS1gs  693023010811  [693023010811]

### Nets
+4V: C1gs.1 C2gs.1 C3gs.1 C4gs.1 DD1gs.34(VBAT) DD1gs.35(VBAT) R10gs.2 R11gs.2 VD1gs.1
GND: C1gs.2 C2gs.2 C3gs.2 C4gs.2 C5gs.2 C6gs.2 C7gs.2 DD1gs.8(GND) DD1gs.13(GND) DD1gs.19(GND) DD1gs.21(GND) DD1gs.27(GND) DD1gs.30(GND) DD1gs.31(GND) DD1gs.33(GND) DD1gs.36(GND) DD1gs.37(GND) R6gs.1 R7gs.1 R12gs.1 R13gs.1 R14gs.1 R15gs.1 VD1gs.2 VD2gs.2 VD2gs.5 VD3gs.1 VT1gs.2(S) VT2gs.2(S) VT3gs.2(S) X1gs.2 XS1gs.1 XS1gs.2 XS1gs.3 XS1gs.4 XS1gs.5 XS1gs.C5
GSM_EN: R15gs.2 TP5gs.1 VT3gs.1(G)
GSM_NETLIGHT: DD1gs.41(NETLIGHT) R14gs.2 VT2gs.1(G)
GSM_PWRKEY: DD1gs.39(PWRKEY) VT3gs.3(D)
GSM_STATUS: DD1gs.42(STATUS) R13gs.2 TP6gs.1 VT1gs.1(G)
GSM_UART1_RX: DD1gs.2(UART1_RXD) R9gs.1 R12gs.2
GSM_UART1_TX: DD1gs.1(UART1_TXD) R8gs.1
MK_GSM_RX: R8gs.2 TP4gs.1
MK_GSM_TX: R9gs.2 TP2gs.1
SIM_CLK: C6gs.1 DD1gs.16(SIM_CLK) R3gs.2 TP10gs.1
SIM_DATA: R2gs.1 TP9gs.1 VD2gs.4 XS1gs.C7
SIM_DET: DD1gs.14(SIM_DET) R1gs.2 TP7gs.1 VD3gs.2 XS1gs.SW
SIM_EXT_VDD: DD1gs.40(VDD_EXT) R1gs.1
SIM_RST: DD1gs.17(SIM_RST) R4gs.2 TP11gs.1
SIM_VDD: C5gs.1 DD1gs.18(SIM_VDD) TP12gs.1 VD2gs.3 XS1gs.C1
NetC7gs_1: C7gs.1 DD1gs.28(VRTC)
NetDD1gs_15: DD1gs.15(SIM_DATA) R2gs.2
NetDD1gs_32: DD1gs.32(GSM_ANT) R5gs.1 R6gs.2
NetR3gs_1: R3gs.1 VD2gs.6 XS1gs.C3
NetR4gs_1: R4gs.1 VD2gs.1 XS1gs.C2
NetR5gs_2: R5gs.2 R7gs.2 X1gs.1
NetR10gs_1: R10gs.1 VD4gs.1
NetR11gs_1: R11gs.1 VD5gs.1
NetVD4gs_2: VD4gs.2 VT1gs.3(D)
NetVD5gs_2: VD5gs.2 VT2gs.3(D)

Not connected (* = marked no-connect by the designer): DD1gs 3(UART1_RTS) 4(UART1_CTS) 5(UART1_DCD) 6(UART1_DTR) 7(UART1_RI) 9(MICP)* 10(MICN)* 11(SPKP)* 12(SPKN)* 20(BT_ANT)* 22(UART2_TXD)* 23(UART2_TXD)* 24(USB_VBUS)* 25(USB_DP)* 26(USB_DN)* 29(RF_SYNC)* 38(ADC)*; X2gs 1* 2*; XS1gs C4* C6* C8*

### Notes on the sheet
- (in symbol 693023010811) Цепь; DETECT; I/O; CLK; RST; Vdd; Vpp; RFU; GND; FREE PAD
- (in symbol SIM800C) GSM
- (in symbol 693022010811) Цепь; DETECT; I/O; CLK; RST; Vdd; Vpp; GND; SHIELD

### Library data of the parts
C1gs = TPSD107M010R0050: CAP SMD TANT 100UF 20% 10V 2917; Manufacturer 1: KYOCERA AVX; Type: Molded; ESR: 50mOhm; Manufacturer Part Number 1: TPSD107M010R0050; Min Operating Temperature: -55°C; Max Operating Temperature: 125°C; Tolerance: 20%; Size Code: 2917; Mounting: SM; Package: D
C2gs C7gs = CL21A475KBQNNNE: CAP SMD CER 4.7UF 50V X5R 0805; Manufacturer 1: Samsung Electro-Mechanics; Tolerance: 10%; Type: Multilayer Ceramic; Manufacturer Part Number 1: CL21A475KBQNNNE; Min Operating Temperature: -55°C; Max Operating Temperature: 85°C; Mounting: SM; Package: 0805; Supplier 1: Digi-Key; Supplier Part Number 1: 1276-1248-1-ND
C3gs = C0603C330J5GAC7867: CAP SMD CER 33PF 50V C0G/NP0 0603; Manufacturer 1: KEMET; Tolerance: 5%; Type: Multilayer Ceramic; Manufacturer Part Number 1: C0603C330J5GAC7867; Min Operating Temperature: -55°C; Max Operating Temperature: 125°C; Mounting: SM; Package: 0603; Supplier 1: Digi-Key
C4gs = CC0603JRNPO9BN100: CAP SMD CER 10PF 50V C0G/NP0 0603; Manufacturer 1: YAGEO; Tolerance: 5%; Type: Multilayer Ceramic; Manufacturer Part Number 1: CC0603JRNPO9BN100; Min Operating Temperature: -55°C; Max Operating Temperature: 125°C; Mounting: SM; Package: 0603; Supplier 1: Digi-Key; Supplier Part Number 1: 311-1058-1-ND
C5gs = GCM188R71H104KA57D: CAP SMD CER 0.1UF 50V X7R 0603; Manufacturer 1: Murata Electronics; Tolerance: 10%; Type: Multilayer Ceramic; Manufacturer Part Number 1: GCM188R71H104KA57D; Min Operating Temperature: -55°C; Max Operating Temperature: 125°C; Mounting: SM; Package: 0603; Supplier 1: Digi-Key; Supplier Part Number 1: 490-4779-1-ND
C6gs = CC0603JRNPO9BN220: CAP SMD CER 22PF 50V NP0  0603; Manufacturer 1: YAGEO; Tolerance: 5%; Type: Multilayer Ceramic; Manufacturer Part Number 1: CC0603JRNPO9BN220; Min Operating Temperature: -55°C; Max Operating Temperature: 125°C; Mounting: SM; Package: 0603; Supplier 1: Digi-Key; Supplier Part Number 1: 311-1062-1-ND
DD1gs = SIM800C: GSM/GPRS Module; Manufacturer 1: SIMCom; Supply Voltage: 4V; Manufacturer Part Number 1: SIM800C; Max Operating Temperature: +85 °C; Min Operating Temperature: -40 °C; Parameter 6: *; Parameter 7: *; Parameter 8: *; Parameter 9: *; Parameter 10: *; Parameter 11: *; Parameter 12: *; Parameter 13: *; Parameter 14: *; Parameter 15: *
R1gs = RMCF0603FT4K70: RES SMD 4.7k OHM 1% 1/10W 0603; Manufacturer 1: Stackpole Electronics Inc; Rated Voltage: 75V; Qualification: AEC-Q200; Manufacturer Part Number 1: RMCF0603FT4K70; Tolerance: 1%; Package: 0603; Min Operating Temperature: -55°C; Max Operating Temperature: 155°C
R2gs R3gs R4gs = RMCF0603FT51R0: RES SMD 51 OHM 1% 1/10W 0603; Manufacturer 1: Stackpole Electronics Inc; Rated Voltage: 75V; Qualification: AEC-Q200; Manufacturer Part Number 1: RMCF0603FT51R0; Tolerance: 1%; Package: 0603; Min Operating Temperature: -55°C; Max Operating Temperature: 155°C
R5gs = RMCF0603ZT0R00: RES SMD 0 OHM 1% 1/10W 0603; Manufacturer 1: Stackpole Electronics Inc; Rated Voltage: 75V; Qualification: AEC-Q200; Manufacturer Part Number 1: RMCF0603ZT0R00; Tolerance: 1%; Package: 0603; Min Operating Temperature: -55°C; Max Operating Temperature: 155°C
R6gs R7gs = RES GOST: RES SMD/TH ?R (&K) OHM ?% ?W (PACKAGE)
R8gs R9gs = RMCF0603FT1K00: RES SMD 1K OHM 1% 1/10W 0603; Manufacturer 1: Stackpole Electronics Inc; Rated Voltage: 75V; Qualification: AEC-Q200; Manufacturer Part Number 1: RMCF0603FT1K00; Tolerance: 1%; Package: 0603; Min Operating Temperature: -55°C; Max Operating Temperature: 155°C
R10gs R11gs = RMCF0603JT510R: RES SMD 510 OHM 5% 1/10W 0603; Manufacturer 1: Stackpole Electronics Inc; Voltage Rated: 75V; Manufacturer Part Number 1: RMCF0603JT510R; Min Operating Temperature: -55°C; Max Operating Temperature: 155°C; Tolerance: 5%; Package: 0603; Ratings: AEC-Q200; Supplier 1: Digi-Key; Supplier Part Number 1: RMCF0603JT510RCT-ND
R12gs = RMCF0603FT5K60: RES SMD 5.6K OHM 1% 1/10W 0603; Manufacturer Part Number 1: RMCF0603FT1K00; Manufacturer 1: Stackpole Electronics Inc; Rated Voltage: 75V; Qualification: AEC-Q200; Tolerance: 1%; Package: 0603; Min Operating Temperature: -55°C; Max Operating Temperature: 155°C
R13gs R14gs R15gs = RMCF0603FT100K: RES SMD 100K OHM 5% 1/10W 0603; Manufacturer 1: Stackpole Electronics Inc; Voltage Rated: 75V; Manufacturer Part Number 1: RMCF0603FT100K; Min Operating Temperature: -55°C; Max Operating Temperature: 155°C; Tolerance: 5%; Package: 0603; Ratings: AEC-Q200; Supplier 1: Digi-Key; Supplier Part Number 1: RMCF0603FT100KCT-ND
TP2gs TP4gs TP5gs TP6gs TP7gs TP9gs TP10gs TP11gs TP12gs = Testpoint 1.2mm
VD1gs = MMSZ5231B-E3-08: DIODE ZENER 5.1V 500MW SOD123; Manufacturer 1: Vishay General Semiconductor - Diodes Division; Tolerance: 5%; Max Impedance: 17 Ohm; Reverse Current: 5uA; Manufacturer Part Number 1: MMSZ5231B-E3-08; Min Operating Temperature: -55°C; Max Operating Temperature: 150°C; Zener Voltage: 5.1V; Max Power: 500mW; Package: SOD-123; Mounting: SM
VD2gs = ESDA6V1BC6: TVS DIODE 5VWM SOT23-6; Manufacturer 1: STMicroelectronics; Voltage - Reverse Standoff (Typ): 5V; Voltage - Breakdown (Min): 6.1V; Type: Biderectional; Number Of Chanels: 4; Max Pulse Power: 80W; Manufacturer Part Number 1: ESDA6V1BC6; Mounting: SM; Max Operating Temperature: 125°C; Min Operating Temperature: -40°C; Package: SOT-23-6
VD3gs = SMAJ5.0CA: TVS DIODE 5VWM 9.2VC DO214AC; Manufacturer 1: Littelfuse Inc.; Voltage - Reverse Standoff (Typ): 5V; Voltage - Breakdown (Min): 6.4V; Voltage - Clamping (Max) @ Ipp: 9.2V; Current - Peak Pulse (10/1000µs): 28A (8/20µs); Type: Biderectional; Number Of Chanels: 6; Max Pulse Power: 350W; Manufacturer Part Number 1: SMAJ5.0CA; Mounting: 43.5A; Max Operating Temperature: 150°C; Min Operating Temperature: -65°C; Package: SMA
VD4gs VD5gs = LTST-S220GKT: LED GREEN CLEAR SMD R/A; Manufacturer 1: Lite-On Inc.; Max Continious Current: 30mA; Max Pulse Current: 120mA; Reverse Voltage: 5V; Power Dissipation: 100mW; Forward Voltage: 2.2V; Manufacturer Part Number 1: LTST-S220GKT; Max Operating Temperature: +85°C; Package: 0805
VT1gs VT2gs VT3gs = BSS138-TP: MOSFET N-CH 50V 220MA SOT23; Manufacturer 1: Micro Commercial Co; Type: P-Chanel; Rds On (Max): 3.5Ohm; Vth: 1.5V; Gate Charge: 1.65nC; Vgs Max: 20V; Input Capacitance: 60pF; Max Power Dissipation: 350mW; Vds Max: 50V; Max Drain Current: 220mA; Min Operating Temperature: -55°C; Max Operating Temperature: 150°C; Mounting Type: SM; Package: SOT-23; Manufacturer Part Number 1: BSS138-TP; Supplier 1: Digi-Key; Supplier Part Number 1: BSS138-TPMSCT-ND
X1gs = 1909763-1: CONN UMCC JACK STR 50OHM SMD; pin to pad: 2>2+3
X2gs = W9006M: CABLE ASSY 6" SMA FM TO I-PEX
XS1gs = 693023010811: CONN SMART CARD; Manufacturer 1: Würth Elektronik eiSos GmbH; ComponentLink1 Description: Manufacturer; ComponentLink2 Description: Datasheet; Shielding: Shielded; Connector Type: Connector; ComponentLink1URL: http://www.we-online.de; ComponentLink2URL: http://katalog.we-online.de/em/datasheet/693022010811.pdf; Manufacturer Part Number 1: 693023010811; Pins: 8

## Sheet Схема дискретных входов и выходов.SchDoc
size A2; SheetNumber: 6; SheetTotal: 6
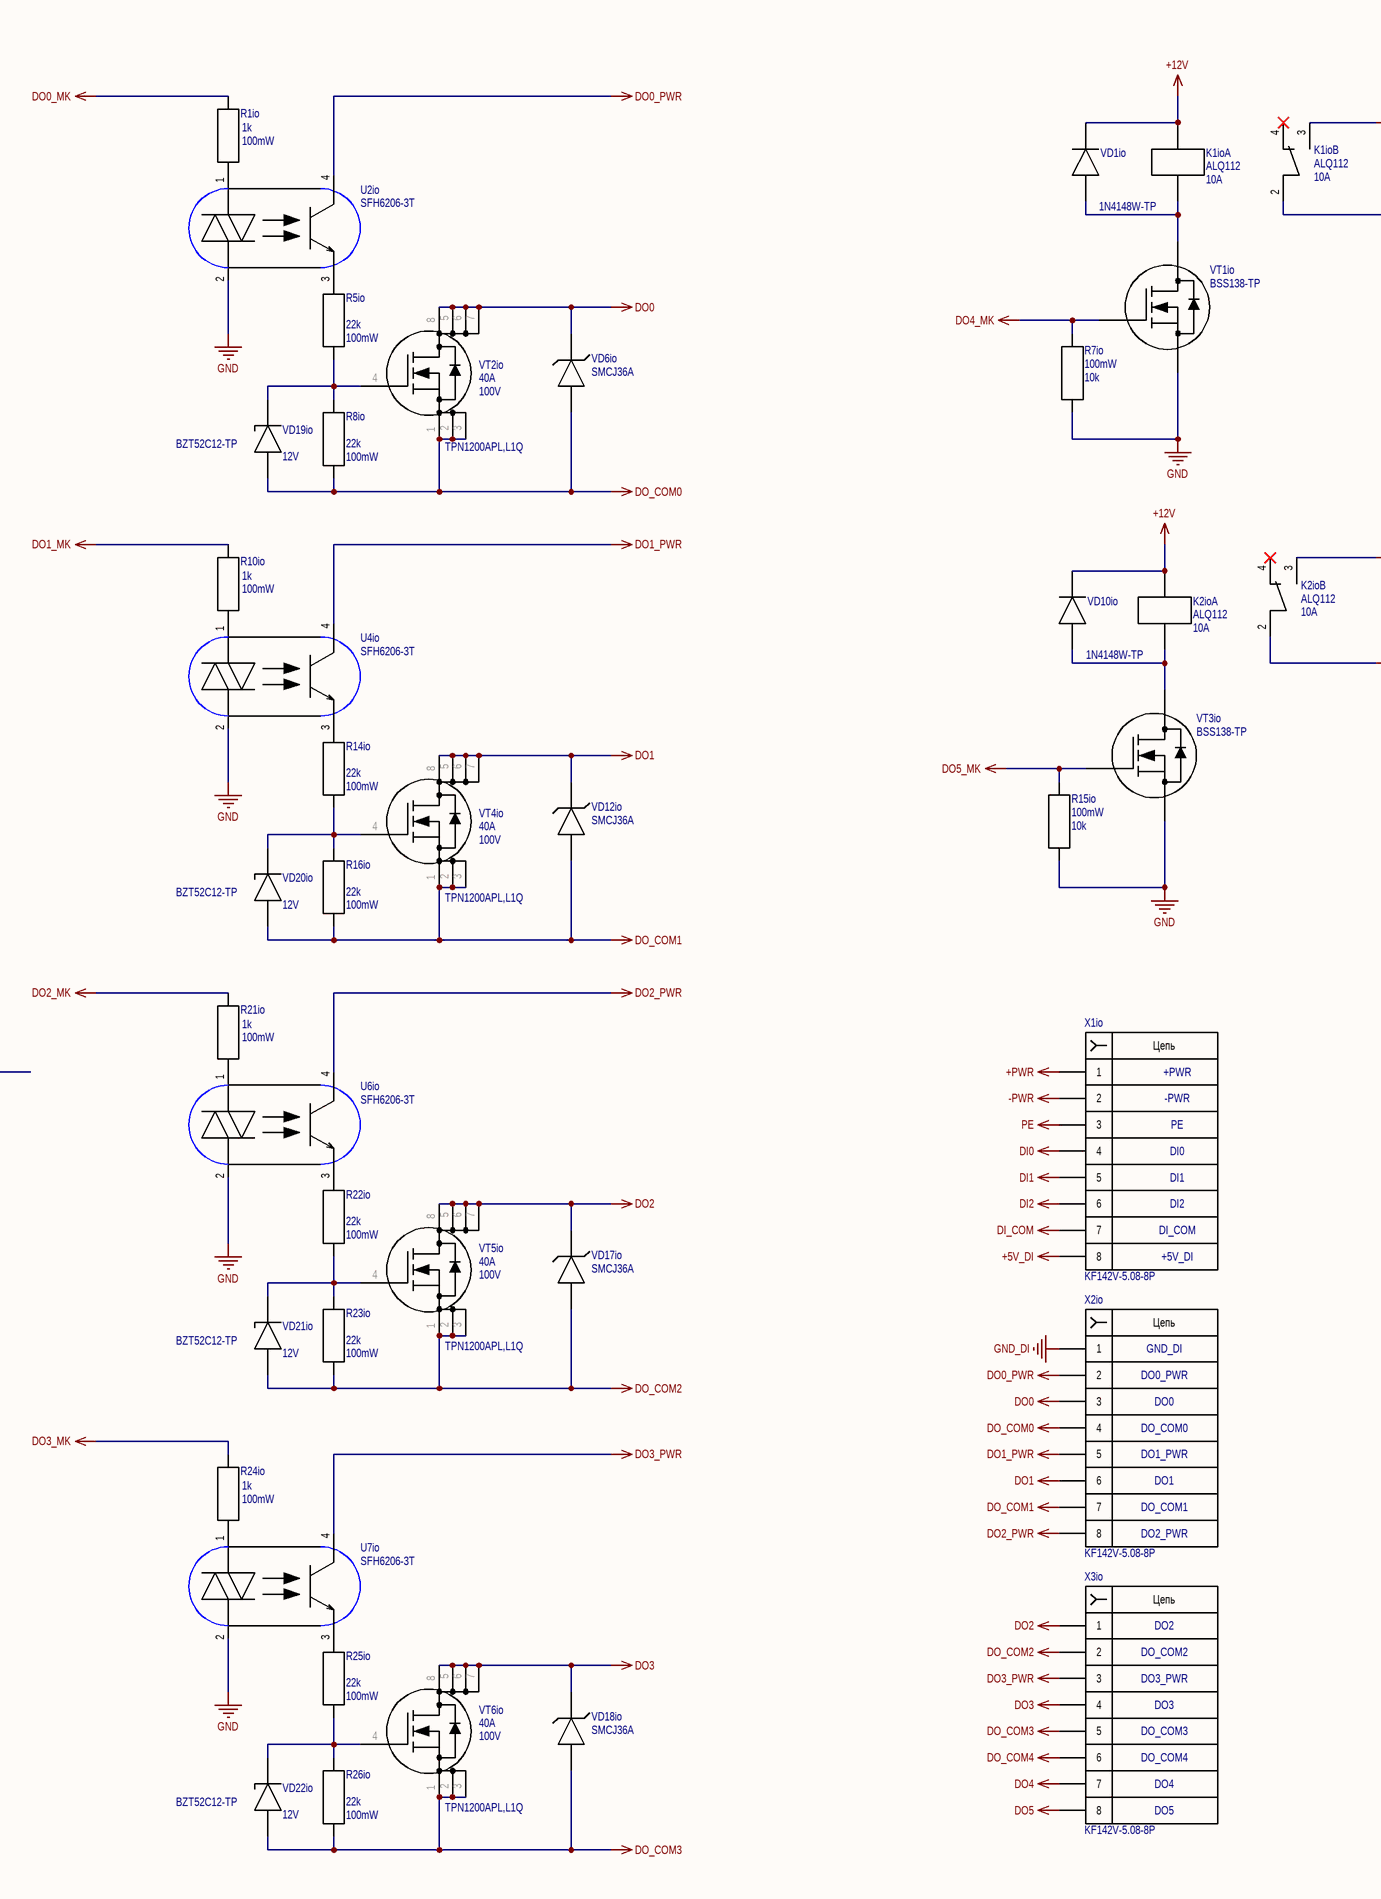
[diagram p6: Схема дискретных входов и выходов.SchDoc, left]
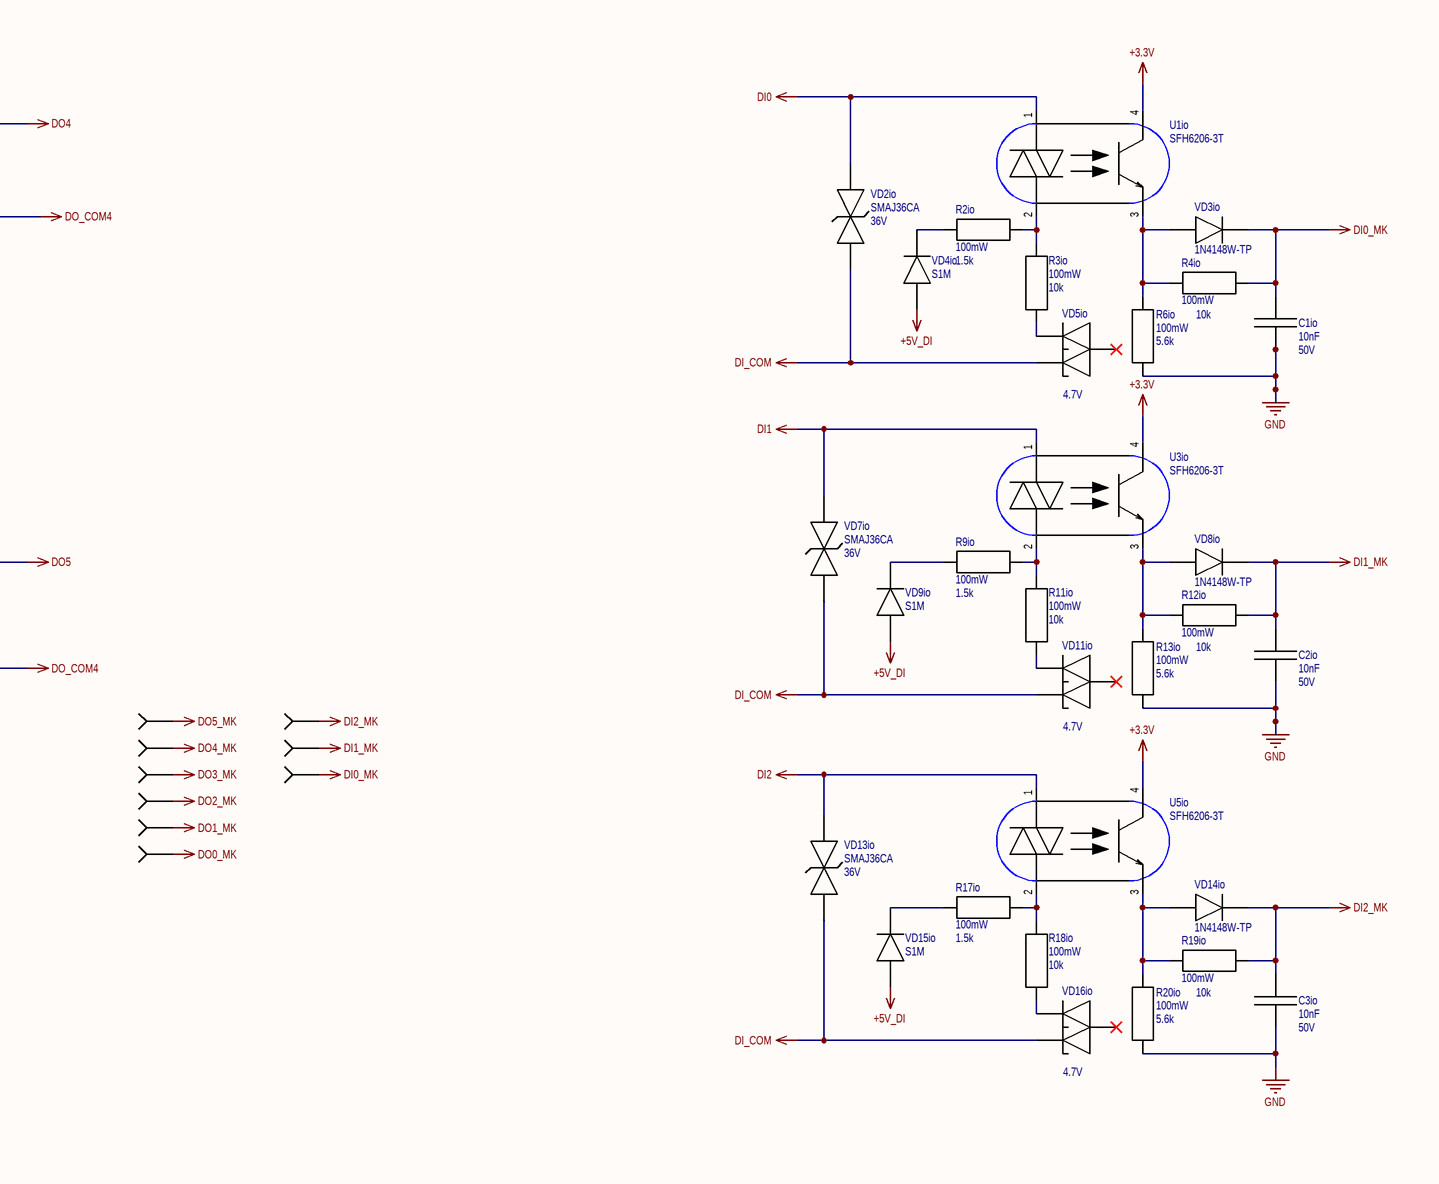
[diagram p7: Схема дискретных входов и выходов.SchDoc, right]

### Parts
C1io  Capacitance: 10nF  Rated Voltage: 50V  [CAP 0603 IPC MAX]  (hidden comment: CL10B103KB8NNNC)
C2io  Capacitance: 10nF  Rated Voltage: 50V  [CAP 0603 IPC MAX]  (hidden comment: CL10B103KB8NNNC)
C3io  Capacitance: 10nF  Rated Voltage: 50V  [CAP 0603 IPC MAX]  (hidden comment: CL10B103KB8NNNC)
K1io  ALQ112  Contact Rating: 10A  [ALQ112]  (parts A,B of 2)
K2io  ALQ112  Contact Rating: 10A  [ALQ112]  (parts A,B of 2)
R1io  Resistance: 1k  Rated Power: 100mW  [RES 0603 IPC MAX]  (hidden comment: RMCF0603FT1K00)
R2io  Power Rated: 100mW  Resistance: 1.5k  [CAP 0603 IPC MAX]  (hidden comment: RMCF0603FT1K50)
R3io  Power Rated: 100mW  Resistance: 10k  [RES 0603 IPC MAX]  (hidden comment: RMCF0603JT10K0)
R4io  Power Rated: 100mW  Resistance: 10k  [RES 0603 IPC MAX]  (hidden comment: RMCF0603JT10K0)
R5io  Resistance: 22k  Power Rated: 100mW  [RES 0603 IPC MAX]  (hidden comment: RMCF0603FT22K0)
R6io  Resistance: 5.6k  Rated Power: 100mW  [RES 0603 IPC MAX]  (hidden comment: RMCF0603FT5K60)
R7io  Power Rated: 100mW  Resistance: 10k  [RES 0603 IPC MAX]  (hidden comment: RMCF0603JT10K0)
R8io  Resistance: 22k  Power Rated: 100mW  [RES 0603 IPC MAX]  (hidden comment: RMCF0603FT22K0)
R9io  Power Rated: 100mW  Resistance: 1.5k  [CAP 0603 IPC MAX]  (hidden comment: RMCF0603FT1K50)
R10io  Resistance: 1k  Rated Power: 100mW  [RES 0603 IPC MAX]  (hidden comment: RMCF0603FT1K00)
R11io  Power Rated: 100mW  Resistance: 10k  [RES 0603 IPC MAX]  (hidden comment: RMCF0603JT10K0)
R12io  Power Rated: 100mW  Resistance: 10k  [RES 0603 IPC MAX]  (hidden comment: RMCF0603JT10K0)
R13io  Resistance: 5.6k  Rated Power: 100mW  [RES 0603 IPC MAX]  (hidden comment: RMCF0603FT5K60)
R14io  Resistance: 22k  Power Rated: 100mW  [RES 0603 IPC MAX]  (hidden comment: RMCF0603FT22K0)
R15io  Power Rated: 100mW  Resistance: 10k  [RES 0603 IPC MAX]  (hidden comment: RMCF0603JT10K0)
R16io  Resistance: 22k  Power Rated: 100mW  [RES 0603 IPC MAX]  (hidden comment: RMCF0603FT22K0)
R17io  Power Rated: 100mW  Resistance: 1.5k  [CAP 0603 IPC MAX]  (hidden comment: RMCF0603FT1K50)
R18io  Power Rated: 100mW  Resistance: 10k  [RES 0603 IPC MAX]  (hidden comment: RMCF0603JT10K0)
R19io  Power Rated: 100mW  Resistance: 10k  [RES 0603 IPC MAX]  (hidden comment: RMCF0603JT10K0)
R20io  Resistance: 5.6k  Rated Power: 100mW  [RES 0603 IPC MAX]  (hidden comment: RMCF0603FT5K60)
R21io  Resistance: 1k  Rated Power: 100mW  [RES 0603 IPC MAX]  (hidden comment: RMCF0603FT1K00)
R22io  Resistance: 22k  Power Rated: 100mW  [RES 0603 IPC MAX]  (hidden comment: RMCF0603FT22K0)
R23io  Resistance: 22k  Power Rated: 100mW  [RES 0603 IPC MAX]  (hidden comment: RMCF0603FT22K0)
R24io  Resistance: 1k  Rated Power: 100mW  [RES 0603 IPC MAX]  (hidden comment: RMCF0603FT1K00)
R25io  Resistance: 22k  Power Rated: 100mW  [RES 0603 IPC MAX]  (hidden comment: RMCF0603FT22K0)
R26io  Resistance: 22k  Power Rated: 100mW  [RES 0603 IPC MAX]  (hidden comment: RMCF0603FT22K0)
TP1io  1.2MM TP  [TESTPOINT 1.2mm]  (value not drawn)  (no BOM)
TP2io  1.2MM TP  [TESTPOINT 1.2mm]  (value not drawn)  (no BOM)
TP3io  1.2MM TP  [TESTPOINT 1.2mm]  (value not drawn)  (no BOM)
TP4io  1.2MM TP  [TESTPOINT 1.2mm]  (value not drawn)  (no BOM)
TP5io  1.2MM TP  [TESTPOINT 1.2mm]  (value not drawn)  (no BOM)
TP6io  1.2MM TP  [TESTPOINT 1.2mm]  (value not drawn)  (no BOM)
TP7io  1.2MM TP  [TESTPOINT 1.2mm]  (value not drawn)  (no BOM)
TP9io  1.2MM TP  [TESTPOINT 1.2mm]  (value not drawn)  (no BOM)
TP11io  1.2MM TP  [TESTPOINT 1.2mm]  (value not drawn)  (no BOM)
U1io  SFH6206-3T  [11-5L106]
U2io  SFH6206-3T  [11-5L106]
U3io  SFH6206-3T  [11-5L106]
U4io  SFH6206-3T  [11-5L106]
U5io  SFH6206-3T  [11-5L106]
U6io  SFH6206-3T  [11-5L106]
U7io  SFH6206-3T  [11-5L106]
VD1io  1N4148W-TP  [SOD-123 (Marked)]
VD2io  SMAJ36CA  Voltage - Reverse Standoff (Typ): 36V  [DO-214AC Bidirectional]
VD3io  1N4148W-TP  [SOD-123 (Marked)]
VD4io  S1M  [DO-214AC Unidirectional]
VD5io  Zener Voltage: 4.7V  [SOT-23-3]  (hidden comment: AZ23C4V7-HE3-08)
VD6io  SMCJ36A  [DO214-AB (SMC) L3.2W1.52]
VD7io  SMAJ36CA  Voltage - Reverse Standoff (Typ): 36V  [DO-214AC Bidirectional]
VD8io  1N4148W-TP  [SOD-123 (Marked)]
VD9io  S1M  [DO-214AC Unidirectional]
VD10io  1N4148W-TP  [SOD-123 (Marked)]
VD11io  Zener Voltage: 4.7V  [SOT-23-3]  (hidden comment: AZ23C4V7-HE3-08)
VD12io  SMCJ36A  [DO214-AB (SMC) L3.2W1.52]
VD13io  SMAJ36CA  Voltage - Reverse Standoff (Typ): 36V  [DO-214AC Bidirectional]
VD14io  1N4148W-TP  [SOD-123 (Marked)]
VD15io  S1M  [DO-214AC Unidirectional]
VD16io  Zener Voltage: 4.7V  [SOT-23-3]  (hidden comment: AZ23C4V7-HE3-08)
VD17io  SMCJ36A  [DO214-AB (SMC) L3.2W1.52]
VD18io  SMCJ36A  [DO214-AB (SMC) L3.2W1.52]
VD19io  BZT52C12-TP  Zener Voltage: 12V  [SOD-123 (Marked)]
VD20io  BZT52C12-TP  Zener Voltage: 12V  [SOD-123 (Marked)]
VD21io  BZT52C12-TP  Zener Voltage: 12V  [SOD-123 (Marked)]
VD22io  BZT52C12-TP  Zener Voltage: 12V  [SOD-123 (Marked)]
VT1io  BSS138-TP  [SOT-23-3]
VT2io  TPN1200APL,L1Q  Max Drain Current: 40A  Vds Max: 100V  [8-PowerVDFN]
VT3io  BSS138-TP  [SOT-23-3]
VT4io  TPN1200APL,L1Q  Max Drain Current: 40A  Vds Max: 100V  [8-PowerVDFN]
VT5io  TPN1200APL,L1Q  Max Drain Current: 40A  Vds Max: 100V  [8-PowerVDFN]
VT6io  TPN1200APL,L1Q  Max Drain Current: 40A  Vds Max: 100V  [8-PowerVDFN]
X1io  KF142V-5.08-8P  [KF142V-5.08-8P]
X2io  KF142V-5.08-8P  [KF142V-5.08-8P]
X3io  KF142V-5.08-8P  [KF142V-5.08-8P]

### Nets
+3.3V: U1io.4(Collector) U3io.4(Collector) U5io.4(Collector)
+5V_DI: VD4io.2 VD9io.2 VD15io.2 X1io.8
+12V: K1io.1 K2io.1 VD1io.1 VD10io.1
+PWR: X1io.1
-PWR: X1io.2
DI0: U1io.1 VD2io.2 X1io.4
DI0_MK: C1io.1 R4io.1 TP6io.1 VD3io.1
DI1: U3io.1 VD7io.2 X1io.5
DI1_MK: C2io.1 R12io.1 TP4io.1 VD8io.1
DI2: U5io.1 VD13io.2 X1io.6
DI2_MK: C3io.1 R19io.1 TP2io.1 VD14io.1
DI_COM: VD2io.1 VD5io.2 VD7io.1 VD11io.2 VD13io.1 VD16io.2 X1io.7
DO0: VD6io.2 VT2io.5 VT2io.6 VT2io.7 VT2io.8(D) X2io.3
DO0_MK: R1io.1 TP11io.1
DO0_PWR: U2io.4(Collector) X2io.2
DO1: VD12io.2 VT4io.5 VT4io.6 VT4io.7 VT4io.8(D) X2io.6
DO1_MK: R10io.1 TP9io.1
DO1_PWR: U4io.4(Collector) X2io.5
DO2: VD17io.2 VT5io.5 VT5io.6 VT5io.7 VT5io.8(D) X3io.1
DO2_MK: R21io.1 TP7io.1
DO2_PWR: U6io.4(Collector) X2io.8
DO3: VD18io.2 VT6io.5 VT6io.6 VT6io.7 VT6io.8(D) X3io.4
DO3_MK: R24io.1 TP5io.1
DO3_PWR: U7io.4(Collector) X3io.3
DO4: K1io.3 X3io.7
DO4_MK: R7io.2 TP3io.1 VT1io.1(G)
DO5: K2io.3 X3io.8
DO5_MK: R15io.2 TP1io.1 VT3io.1(G)
DO_COM0: R8io.1 VD6io.1 VD19io.2 VT2io.1(S) VT2io.2(S) VT2io.3(S) X2io.4
DO_COM1: R16io.1 VD12io.1 VD20io.2 VT4io.1(S) VT4io.2(S) VT4io.3(S) X2io.7
DO_COM2: R23io.1 VD17io.1 VD21io.2 VT5io.1(S) VT5io.2(S) VT5io.3(S) X3io.2
DO_COM3: R26io.1 VD18io.1 VD22io.2 VT6io.1(S) VT6io.2(S) VT6io.3(S) X3io.5
DO_COM4: K1io.2 K2io.2 X3io.6
GND: C1io.2 C2io.2 C3io.2 R6io.1 R7io.1 R13io.1 R15io.1 R20io.1 U2io.2 U4io.2 U6io.2 U7io.2 VT1io.2(S) VT3io.2(S)
GND_DI: X2io.1
PE: X1io.3
NetK1io_5: K1io.5 VD1io.2 VT1io.3(D)
NetK2io_5: K2io.5 VD10io.2 VT3io.3(D)
NetR1io_2: R1io.2 U2io.1
NetR2io_1: R2io.1 VD4io.1
NetR2io_2: R2io.2 R3io.2 U1io.2
NetR3io_1: R3io.1 VD5io.1
NetR4io_2: R4io.2 R6io.2 U1io.3(Emitter) VD3io.2
NetR5io_1: R5io.1 R8io.2 VD19io.1 VT2io.4(G)
NetR5io_2: R5io.2 U2io.3(Emitter)
NetR9io_1: R9io.1 VD9io.1
NetR9io_2: R9io.2 R11io.2 U3io.2
NetR10io_2: R10io.2 U4io.1
NetR11io_1: R11io.1 VD11io.1
NetR12io_2: R12io.2 R13io.2 U3io.3(Emitter) VD8io.2
NetR14io_1: R14io.1 R16io.2 VD20io.1 VT4io.4(G)
NetR14io_2: R14io.2 U4io.3(Emitter)
NetR17io_1: R17io.1 VD15io.1
NetR17io_2: R17io.2 R18io.2 U5io.2
NetR18io_1: R18io.1 VD16io.1
NetR19io_2: R19io.2 R20io.2 U5io.3(Emitter) VD14io.2
NetR21io_2: R21io.2 U6io.1
NetR22io_1: R22io.1 R23io.2 VD21io.1 VT5io.4(G)
NetR22io_2: R22io.2 U6io.3(Emitter)
NetR24io_2: R24io.2 U7io.1
NetR25io_1: R25io.1 R26io.2 VD22io.1 VT6io.4(G)
NetR25io_2: R25io.2 U7io.3(Emitter)

Not connected (* = marked no-connect by the designer): K1io 4*; K2io 4*; VD5io 3*; VD11io 3*; VD16io 3*

### Notes on the sheet
- +PWR
- -PWR
- PE
- DI0
- DI1
- DI2
- DI_COM
- +5V_DI
- GND_DI
- DO0_PWR
- DO0
- DO_COM0
- DO1_PWR
- DO1
- DO_COM1
- DO2_PWR
- DO2
- DO_COM2
- DO3_PWR
- DO3
- DO_COM3
- DO4
- DO_COM4
- DO5
- (in symbol KF142V-5.08-8P) Цепь

### Library data of the parts
C1io C2io C3io = CL10B103KB8NNNC: CAP SMD CER 10000PF 50V X7R 0603; Manufacturer 1: Samsung Electro-Mechanics; Tolerance: 10%; Type: Multilayer Ceramic; Manufacturer Part Number 1: CL10B103KB8NNNC; Min Operating Temperature: -55°C; Max Operating Temperature: 125°C; Mounting: SM; Package: 0603; Supplier 1: Digi-Key; Supplier Part Number 1: 1276-1009-1-ND
K1io K2io = ALQ112: RELAY GEN PURPOSE SPDT 10A 12V; Manufacturer 1: Panasonic Electric Works; Contact Form: SPDT (1 Form C); Max Switching Voltage: 250VAC; Coil Current: 33.3mA; Coil Resistance: 360mOhm; Coil Type: Non Latching; Manufacturer Part Number 1: ALQ112; Min Operating Temperature: -40°C; Max Operating Temperature: 85°C; Package: 20mm x 10mm x 15.6mm; Mounting: T/H; Supplier 1: Digi-Key; Supplier Part Number 1: 255-3562-ND
R1io R10io R21io R24io = RMCF0603FT1K00: as R8gs on sheet Схема GSM Velvet Controller; Manufacturer Part Number 1: RMCF0603FT1K00; Tolerance: 1%; Package: 0603; Min Operating Temperature: -55°C; Max Operating Temperature: 155°C
R2io R9io R17io = RMCF0603FT1K50: RES SMD 1.5K OHM 1% 1/10W 0603; Manufacturer 1: Stackpole Electronics Inc; Voltage Rated: 75V; Manufacturer Part Number 1: RMCF0603FT1K50; Min Operating Temperature: -55°C; Max Operating Temperature: 155°C; Tolerance: 1%; Package: 0603; Ratings: AEC-Q200; Supplier 1: Digi-Key; Supplier Part Number 1: RMCF0603FT1K50CT-ND
R3io R4io R7io R11io R12io R15io R18io R19io = RMCF0603JT10K0: RES SMD 10K OHM 5% 1/10W 0603; Manufacturer 1: Stackpole Electronics Inc; Voltage Rated: 75V; Manufacturer Part Number 1: RMCF0603JT10K0; Min Operating Temperature: -55°C; Max Operating Temperature: 155°C; Tolerance: 5%; Package: 0603; Ratings: AEC-Q200; Supplier 1: Digi-Key; Supplier Part Number 1: RMCF0603JT10K0CT-ND
R5io R8io R14io R16io R22io R23io R25io R26io = RMCF0603FT22K0: RES SMD 22K OHM 1% 1/10W 0603; Manufacturer 1: Stackpole Electronics Inc; Min Operating Temnperature: -55°C; Voltage Rated: 75V; Manufacturer Part Number 1: RMCF0603FT22K0; Max Operating Temperature: 155°C; Tolerance: 1%; Package: 0603; Mounting: SM; Pins: 2; Rating: AEC-Q200; Supplier 1: Digi-Key; Supplier Part Number 1: RMCF0603FT22K0CT-ND
R6io R13io R20io = RMCF0603FT5K60: as R12gs on sheet Схема GSM Velvet Controller; Tolerance: 1%; Package: 0603; Min Operating Temperature: -55°C; Max Operating Temperature: 155°C
TP1io TP2io TP3io TP4io TP5io TP6io TP7io TP9io TP11io = Testpoint 1.2mm
U1io U2io U3io U4io U5io U6io U7io = SFH6206-3T: OPTOISOLATOR 5.3KV TRANS 4-SMD; Manufacturer 1: Vishay Semiconductor Opto Division; Min Current Transfer Ratio: 100%; Max Current Transfer Ratio: 320%; Output Type: Transistor; Max Output Voltage: 70V; Max Output Current: 50mA; Turn On/Off Time: 3us; Manufacturer Part Number 1: SFH6206-3T; Min Operating Temperature: -55°C; Max Operating Temperature: 100°C; Mounting: SM; Package: 4-SOIC; Rise/Fall Time: 3us
VD1io VD3io VD8io VD10io VD14io = 1N4148W-TP: DIODE GEN PURP 100V 150MA SOD123; Manufacturer 1: Micro Commercial Co; Max Voltage RMS: 71V; Maximum Forward Voltage: 1.25V; Manufacturer Part Number 1: 1N4148W-TP; Max Voltage Peak: 100V; Max Voltage DC: 100V; Max Forward Current: 150mA; Max Operating Temperature: 150°C; Min Operating Temperature: -65°C; Package: SOD-123; ComponentLink1Description: Help URL; ComponentLink1URL: *
VD2io VD7io VD13io = SMAJ36CA: TVS DIODE 36VWM 58.1VC DO214AC; Manufacturer 1: Littelfuse Inc.; Voltage - Clamping (Max) @ Ipp: 58.1V; Current - Peak Pulse (10/1000µs): 6.9A; Type: Biderectional; Number Of Chanels: 1; Max Pulse Power: 400W; Voltage - Breakdown (Min): 40V; Manufacturer Part Number 1: SMAJ36CA; Mounting: SM; Max Operating Temperature: 150°C; Min Operating Temperature: -65°C; Package: SMA; Supplier 1: Digi-Key; Supplier Part Number 1: SMAJ36CALFCT-ND
VD4io VD9io VD15io = S1M: DIODE GEN PURP 1KV 1A SMA; Manufacturer 1: SMC Diode Solutions; Max Voltage Peak: 1000V; Max Voltage RMS: 700V; Maximum Forward Voltage: 1.1V; Manufacturer Part Number 1: S1M; Max Voltage DC: 1000V; Max Forward Current: 1A; Max Operating Temperature: 175°C; Min Operating Temperature: -65°C; Package: SMA (DO-214AC); ComponentLink1Description: Help URL; ComponentLink1URL: *
VD5io VD11io VD16io = AZ23C4V7-HE3-08: DIODE ZENER ARRAY 4.7V 300MW SOT23; Manufacturer 1: Vishay General Semiconductor - Diodes Division; Tolerance: 5%; Max Impedance: 78 Ohm; Manufacturer Part Number 1: AZ23C4V7-HE3-08; Min Operating Temperature: -55°C; Max Operating Temperature: 150°C; Max Power: 300mW; Reverse Current: -; Package: SOT-23-3; Mounting: SM; Supplier 1: Digi-Key; Supplier Part Number 1: AZ23C4V7-HE3-08GICT-ND
VD6io VD12io VD17io VD18io = SMCJ36A: TVS DIODE 36VWM 58.1VC DO214AB; Manufacturer 1: Littelfuse Inc.; Typical Breakdown Voltage: 40V; Current - Peak Pulse: 25.9A; Max Pulse Power: 1500W; Max Clamping Voltage: 58.1V; Manufacturer Part Number 1: SMCJ36A; Min Operating Temperature: -55°C; Max Operating Temperature: 150°C; Package: SMC; Mounting: SM
VD19io VD20io VD21io VD22io = BZT52C12-TP: DIODE ZENER 12V 200MW SOD123; Manufacturer 1: Micro Commercial Co; Tolerance: 5%; Max Impedance: 28 Ohm; Reverse Current: 100nA; Manufacturer Part Number 1: BZT52C12-TP; Min Operating Temperature: -65°C; Max Operating Temperature: 150°C; Max Power: 200mW; Package: SOD-123; Mounting: SM; Supplier 1: Digi-Key; Supplier Part Number 1: BZT52C12-TPMSCT-ND
VT1io VT3io = BSS138-TP: as VT1gs on sheet Схема GSM Velvet Controller; Vds Max: 50V; Max Drain Current: 220mA; Min Operating Temperature: -55°C; Max Operating Temperature: 150°C; Mounting Type: SM; Package: SOT-23; Manufacturer Part Number 1: BSS138-TP; Supplier 1: Digi-Key; Supplier Part Number 1: BSS138-TPMSCT-ND
VT2io VT4io VT5io VT6io = TPN1200APL,L1Q: MOSFET N-CH 100V 42A MLPAK33; Manufacturer 1: Toshiba Semiconductor and Storage; Type: N-MOSFET; Rds On (Max): 11.5mOhm; Vth: 2.5V; Gate Charge: 24nC; Vgs Max: 20V; Input Capacitance: 1855pF; Max Power Dissipation: 630mW; Min Operating Temperature: -55°C; Max Operating Temperature: 175°C; Mounting Type: SM; Package: 8-PowerVDFN; Manufacturer Part Number 1: TPN1200APL,L1Q; Supplier 1: DigiKey; Supplier Part Number 1: 264-TPN1200APLL1QCT-ND
X1io X2io X3io = KF142V-5.08-8P: TERMINAL BLOCK 8 PIN 5.08mm 15A 250V T/H; pin to pad: 1>1+9 2>2+10 3>3+11 4>4+12 5>5+13 6>6+14 7>7+15 8>8+16; Manufacturer 1: CIXI KEFA ELECTRONICS CO.,LTD.; Rated Current: 10A; Suitable Wire: 14...22AWG; Pitch: 5.08mm x 7.62mm; Rated Voltage: 250V; Min Operating Temperatire: -40℃; Max Operating Temperature: 105℃; Pins: 8+8; Manufacturer Part Number 1: KF142V-5.08-8P; Max Length: 43.18mm; Max Width: 13.7mm; Max Height: 14.2mm